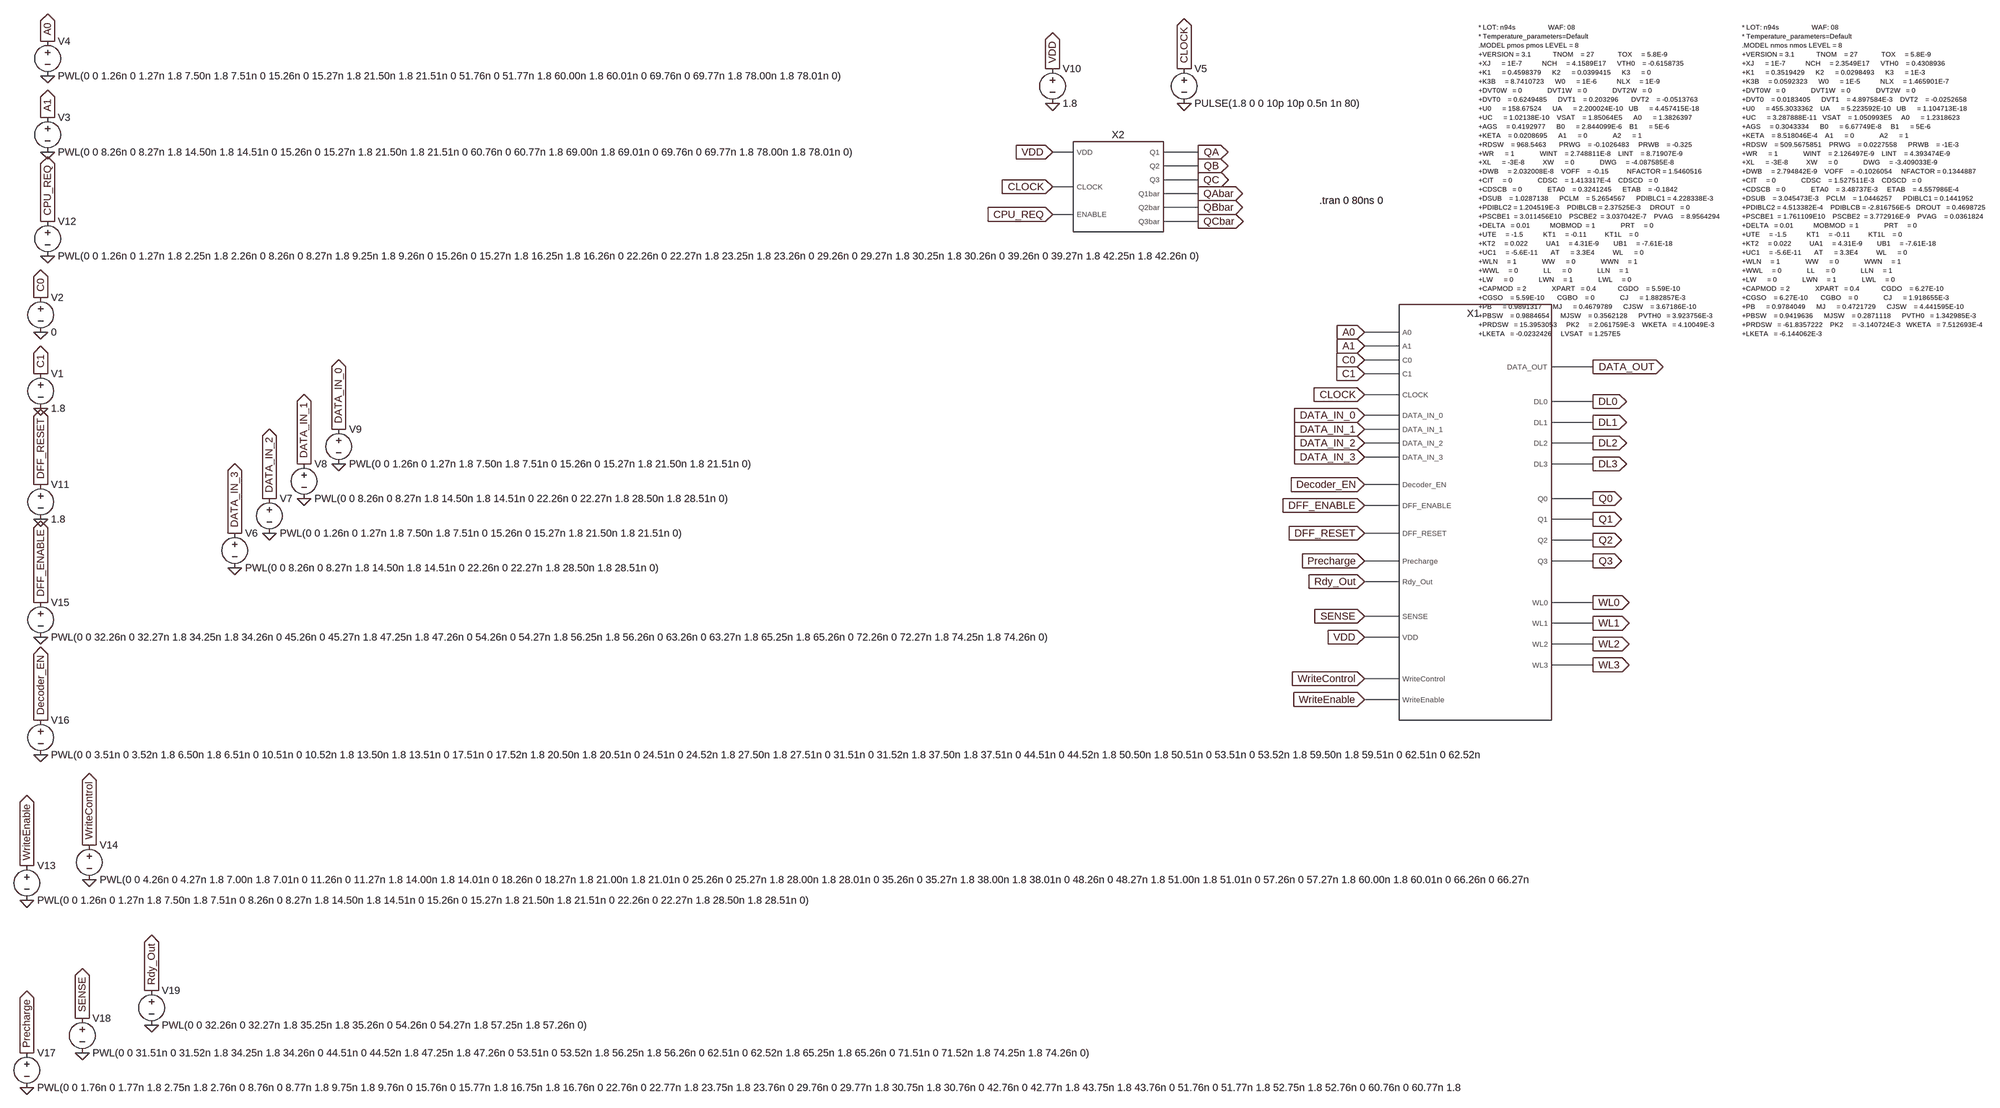
[diagram p0: schematic DRAM_CONTROLLER_2.asc]
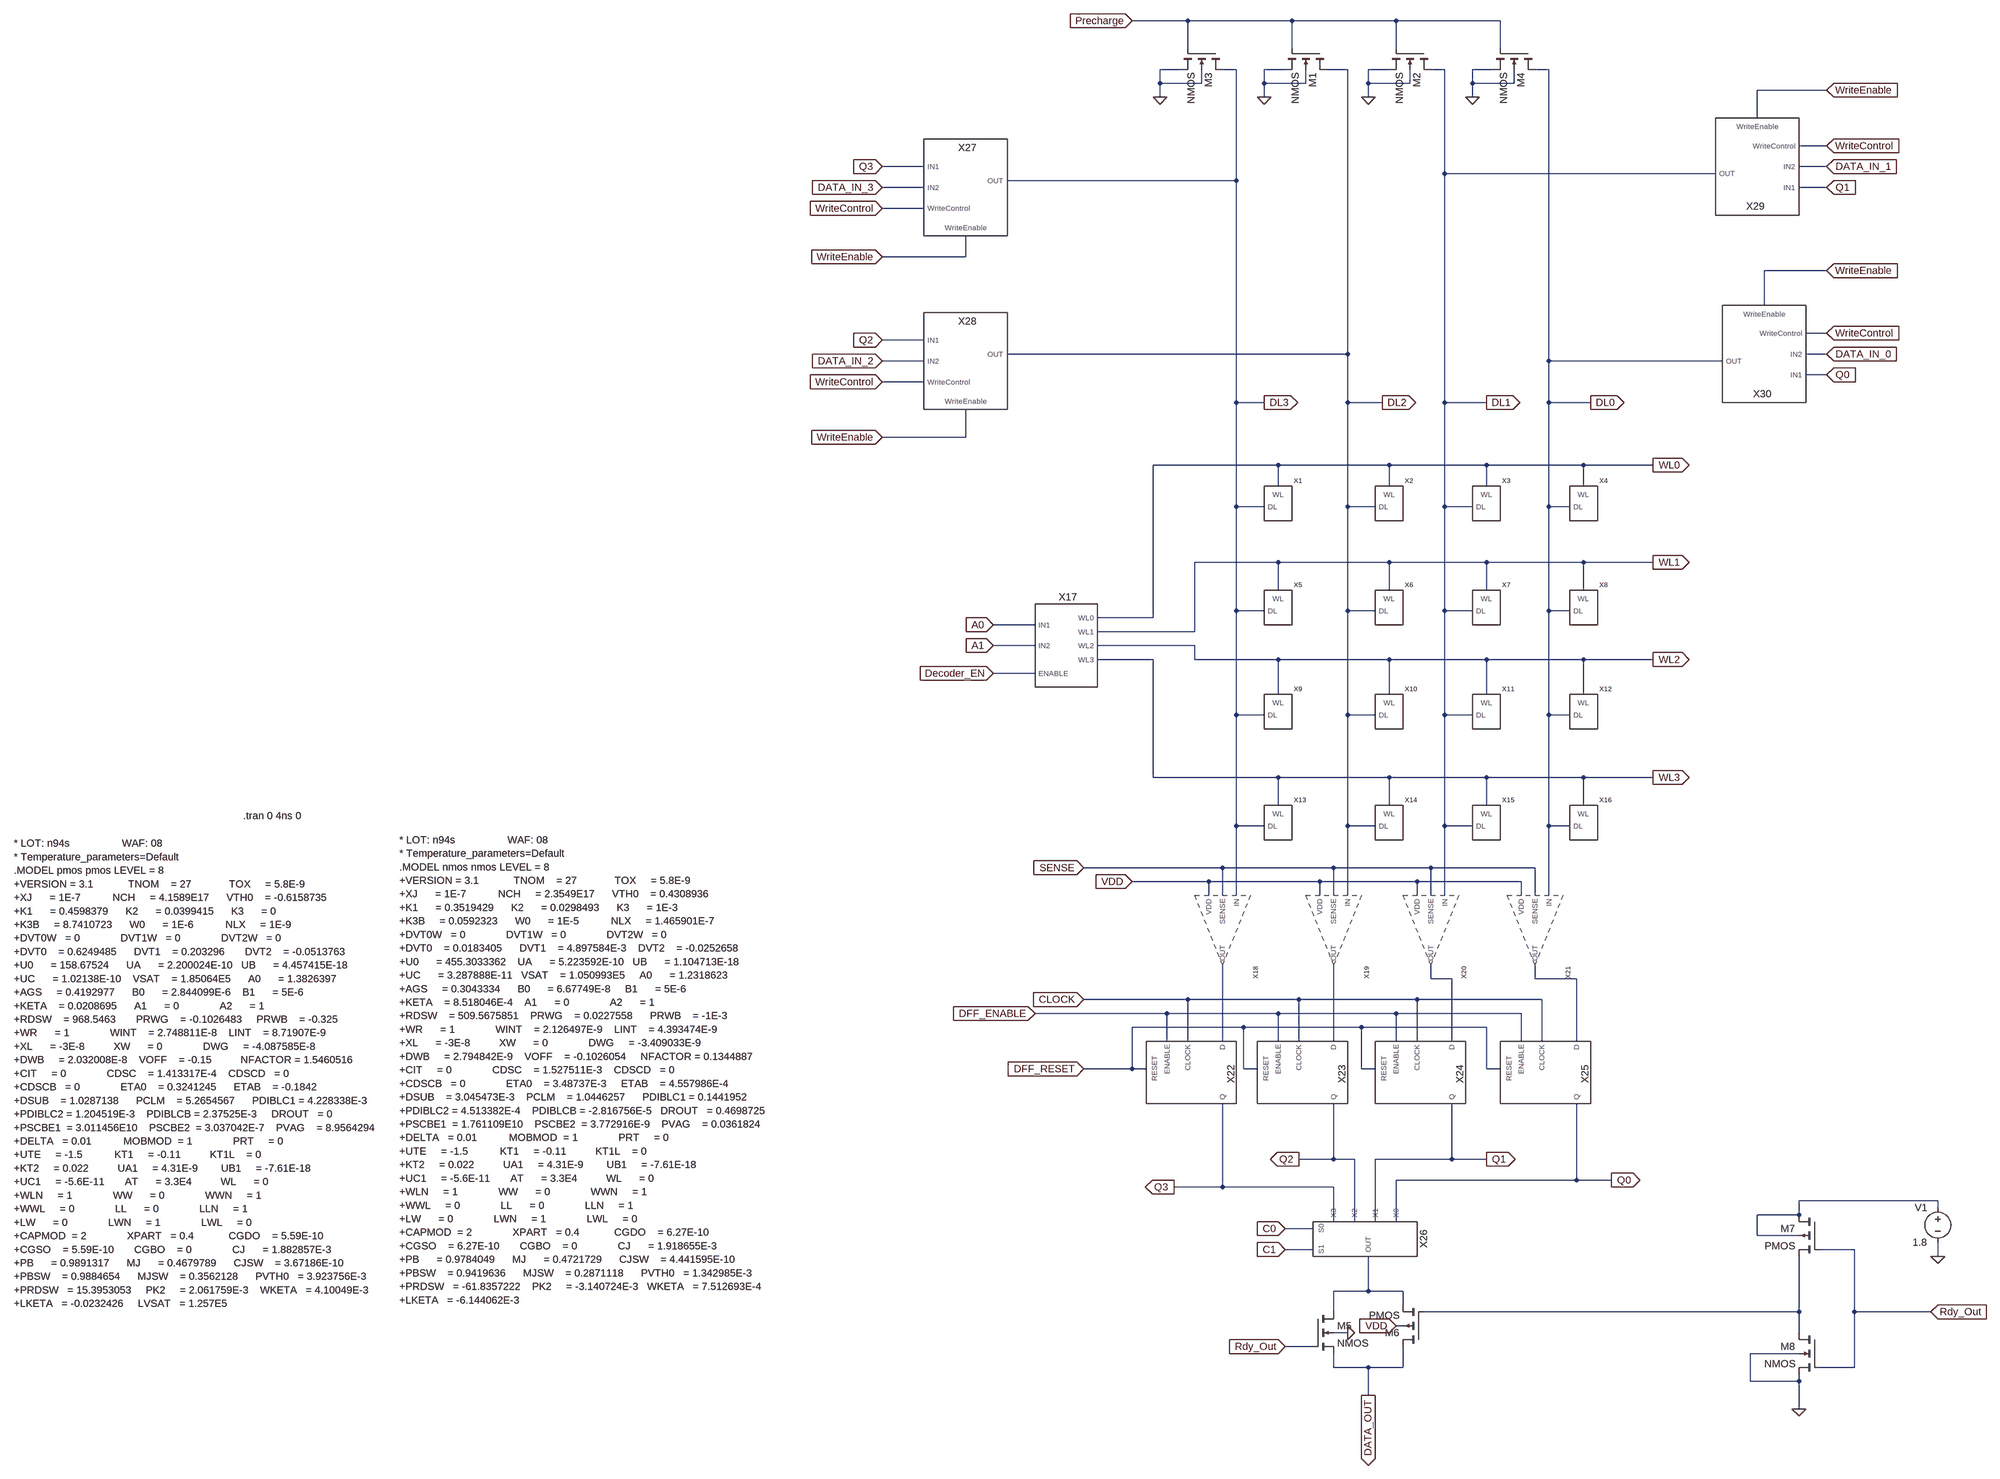
[diagram p1: sub-circuit 4x4_dram.asc]
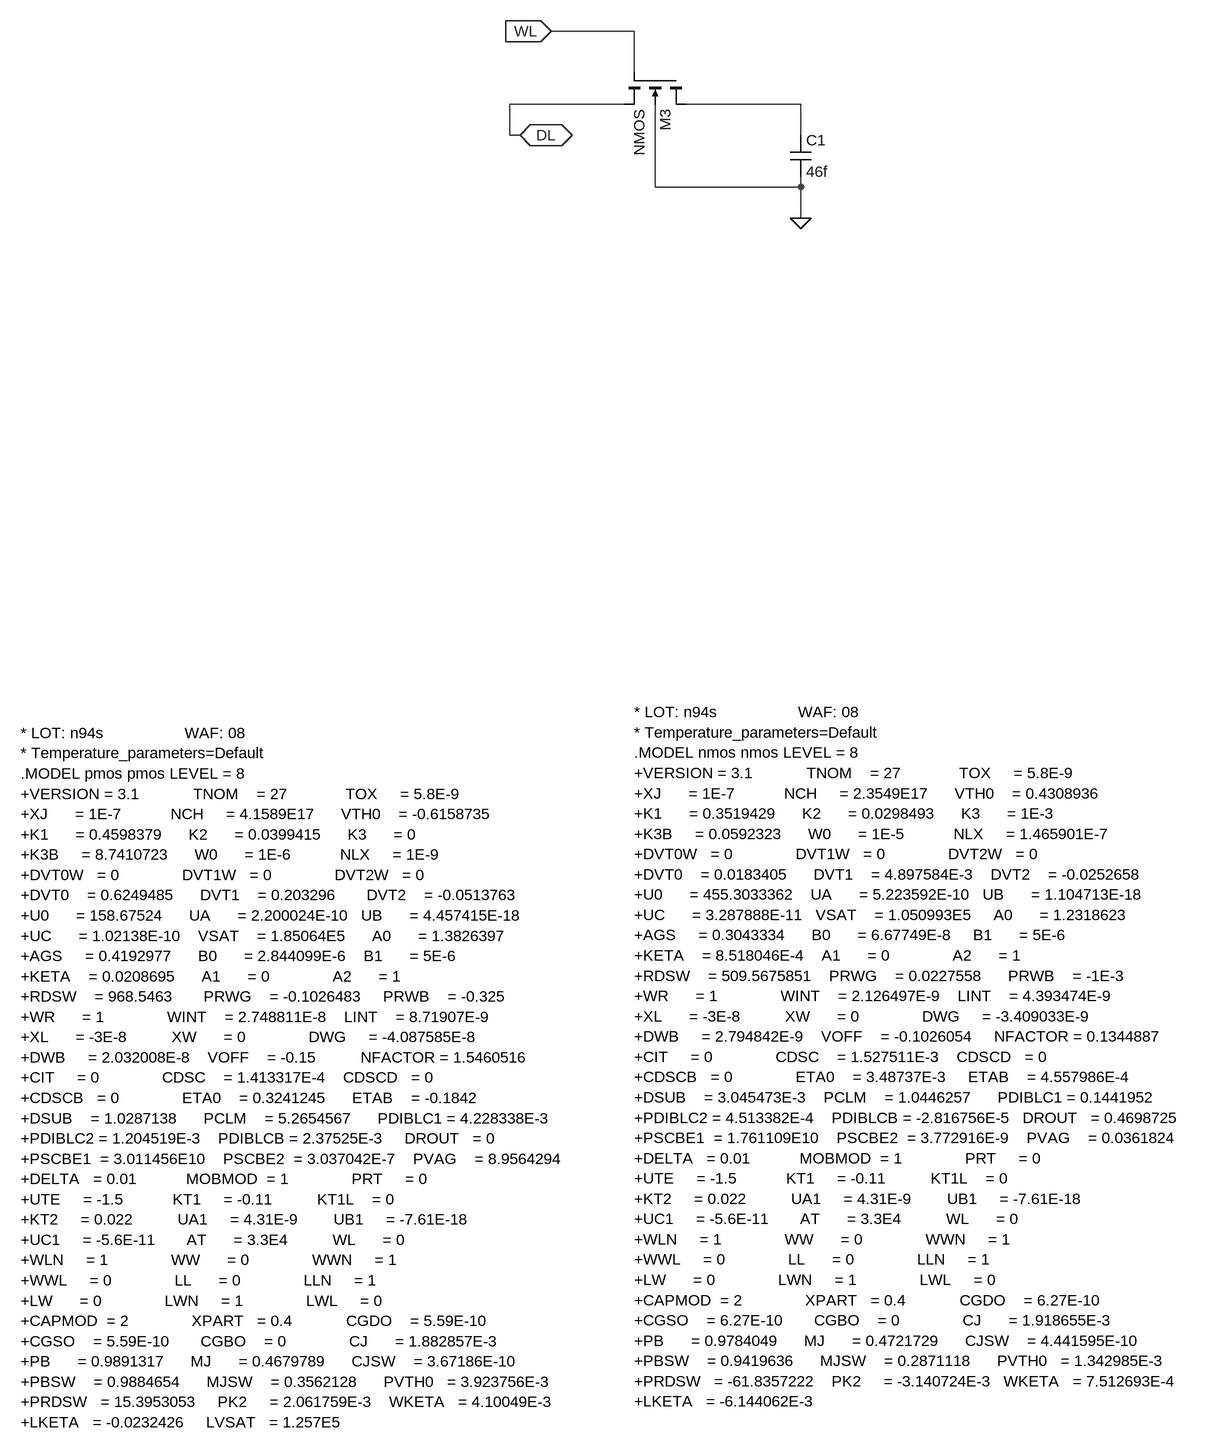
[diagram p2: sub-circuit 1t1c_cell.asc]
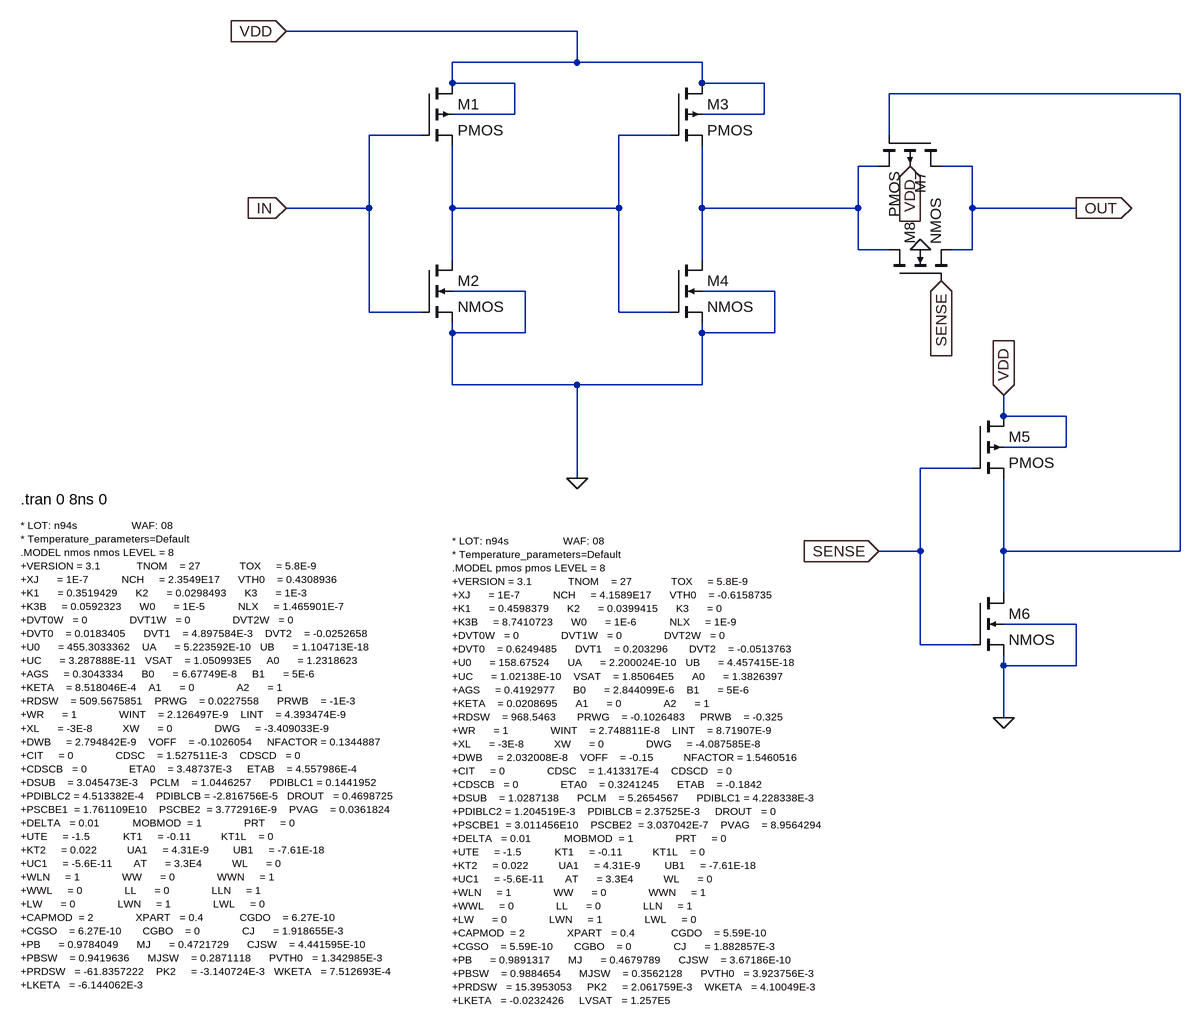
[diagram p3: sub-circuit sense_amplifier_en.asc]
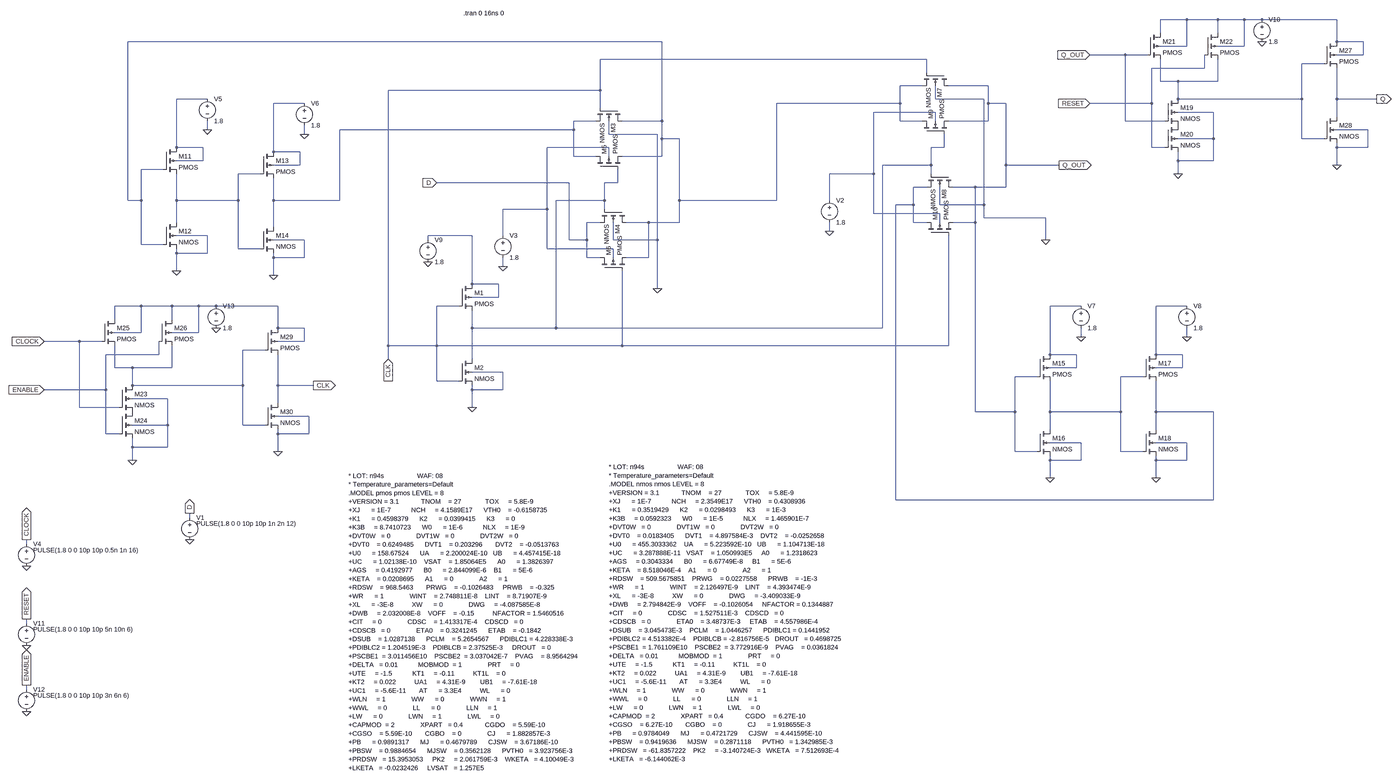
[diagram p4: sub-circuit dff_with_cntrs.asc, whole sheet]
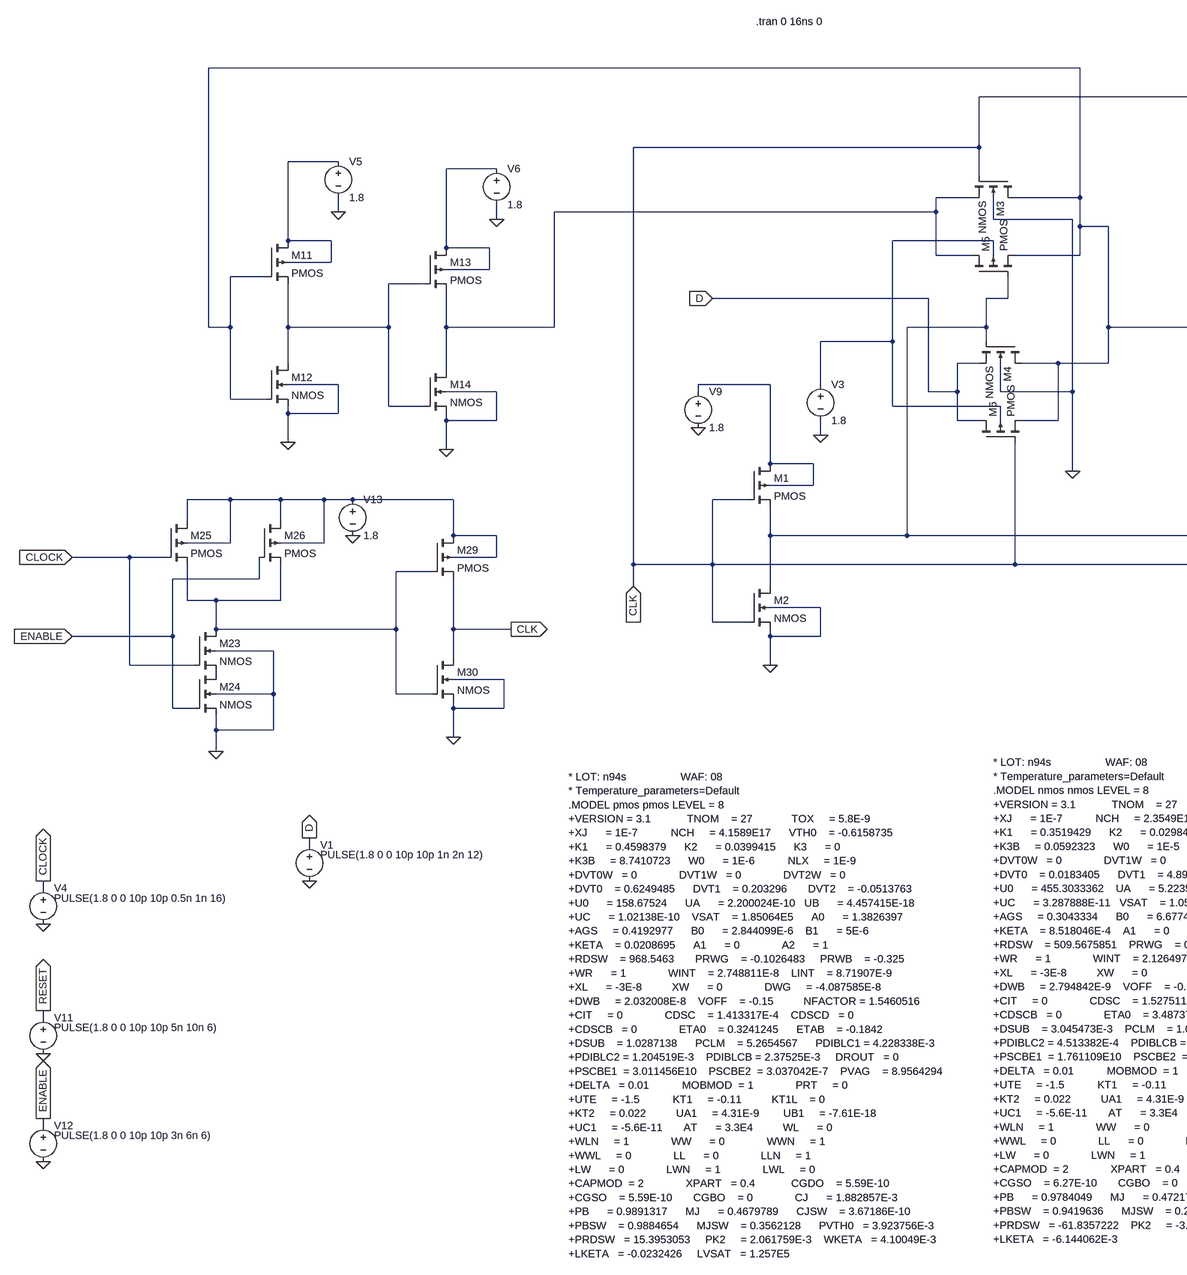
[diagram p5: sub-circuit dff_with_cntrs.asc, part, row 1 of 1, column 1 of 2]
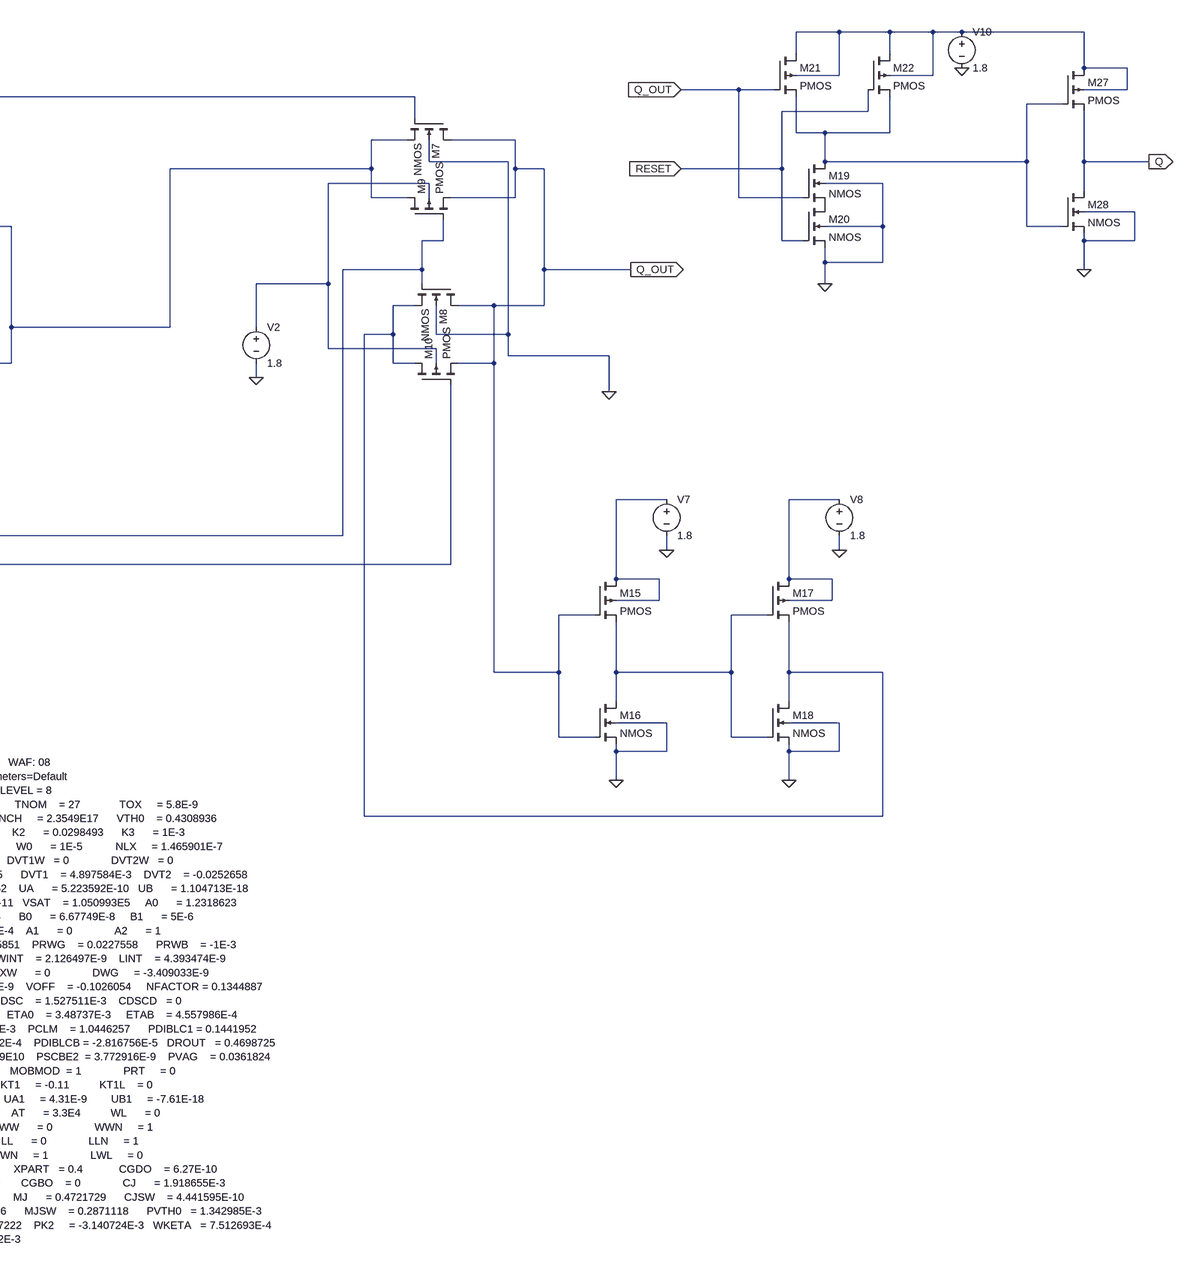
[diagram p6: sub-circuit dff_with_cntrs.asc, part, row 1 of 1, column 2 of 2]
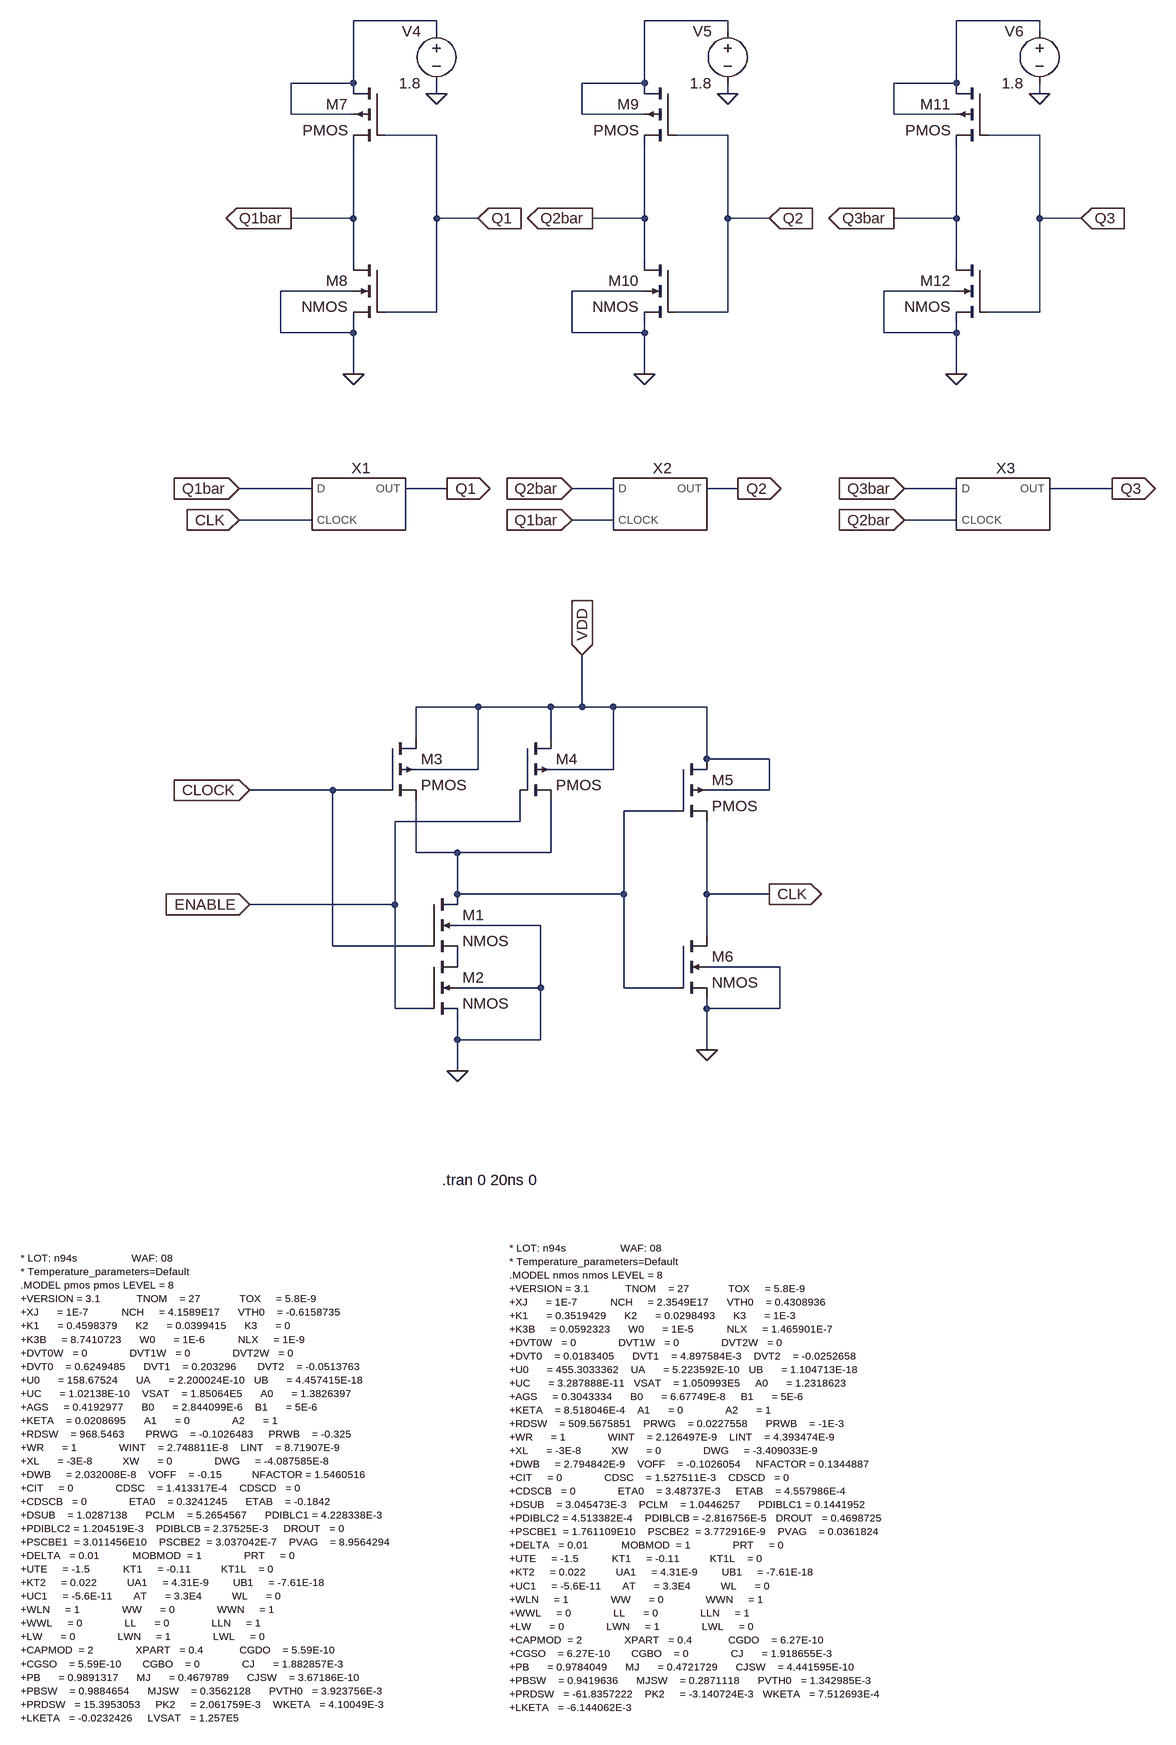
[diagram p7: sub-circuit 3bit_counter.asc]
DRAM_CONTROLLER_2.asc, the LTspice schematic file:
Version 4
SHEET 1 2300 1780
WIRE 112 -912 64 -912
WIRE 400 -912 320 -912
WIRE 400 -880 320 -880
WIRE 400 -848 320 -848
WIRE 112 -832 64 -832
WIRE 400 -816 320 -816
WIRE 400 -784 320 -784
WIRE 112 -768 64 -768
WIRE 400 -752 320 -752
WIRE 864 -496 784 -496
WIRE 864 -464 784 -464
WIRE 864 -432 784 -432
WIRE 1312 -416 1216 -416
WIRE 864 -400 784 -400
WIRE 864 -352 784 -352
WIRE 1312 -336 1216 -336
WIRE 864 -304 784 -304
WIRE 1312 -288 1216 -288
WIRE 864 -272 784 -272
WIRE 864 -240 784 -240
WIRE 1312 -240 1216 -240
WIRE 864 -208 784 -208
WIRE 1312 -192 1216 -192
WIRE 864 -144 784 -144
WIRE 1312 -112 1216 -112
WIRE 864 -96 784 -96
WIRE 1312 -64 1216 -64
WIRE 864 -32 784 -32
WIRE 1312 -16 1216 -16
WIRE 864 32 784 32
WIRE 1312 32 1216 32
WIRE 864 80 784 80
WIRE 1312 128 1216 128
WIRE 864 160 784 160
WIRE 1312 176 1216 176
WIRE 864 208 784 208
WIRE 1312 224 1216 224
WIRE 1312 272 1216 272
WIRE 864 304 784 304
WIRE 864 352 784 352
FLAG -2272 -320 0
FLAG -2272 -496 0
FLAG -2256 -912 0
FLAG -2256 -1088 0
FLAG -2256 -1168 A0
IOPIN -2256 -1168 Out
FLAG -2256 -992 A1
IOPIN -2256 -992 Out
FLAG -2272 -576 C0
IOPIN -2272 -576 Out
FLAG -2272 -400 C1
IOPIN -2272 -400 Out
FLAG 1312 128 WL0
IOPIN 1312 128 Out
FLAG 1312 176 WL1
IOPIN 1312 176 Out
FLAG 1312 224 WL2
IOPIN 1312 224 Out
FLAG 1312 272 WL3
IOPIN 1312 272 Out
FLAG 1312 32 Q3
IOPIN 1312 32 Out
FLAG 1312 -16 Q2
IOPIN 1312 -16 Out
FLAG 1312 -64 Q1
IOPIN 1312 -64 Out
FLAG 1312 -112 Q0
IOPIN 1312 -112 Out
FLAG 1312 -192 DL3
IOPIN 1312 -192 Out
FLAG 1312 -240 DL2
IOPIN 1312 -240 Out
FLAG 1312 -288 DL1
IOPIN 1312 -288 Out
FLAG 1312 -336 DL0
IOPIN 1312 -336 Out
FLAG 1312 -416 DATA_OUT
IOPIN 1312 -416 Out
FLAG 368 -1024 0
FLAG 368 -1104 CLOCK
IOPIN 368 -1104 Out
FLAG -1824 48 0
FLAG -1744 -32 0
FLAG -1664 -112 0
FLAG -1584 -192 0
FLAG -1584 -272 DATA_IN_0
IOPIN -1584 -272 Out
FLAG -1664 -192 DATA_IN_1
IOPIN -1664 -192 Out
FLAG -1744 -112 DATA_IN_2
IOPIN -1744 -112 Out
FLAG -1824 -32 DATA_IN_3
IOPIN -1824 -32 Out
FLAG 64 -1024 0
FLAG 64 -1104 VDD
IOPIN 64 -1104 Out
FLAG -2272 -64 0
FLAG -2272 -144 DFF_RESET
IOPIN -2272 -144 Out
FLAG -2256 -672 0
FLAG -2256 -752 CPU_REQ
IOPIN -2256 -752 Out
FLAG -2304 816 0
FLAG -2304 736 WriteEnable
IOPIN -2304 736 Out
FLAG -2160 768 0
FLAG -2160 688 WriteControl
IOPIN -2160 688 Out
FLAG -2272 208 0
FLAG -2272 128 DFF_ENABLE
IOPIN -2272 128 Out
FLAG -2272 480 0
FLAG -2272 400 Decoder_EN
IOPIN -2272 400 Out
FLAG -2304 1248 0
FLAG -2304 1168 Precharge
IOPIN -2304 1168 Out
FLAG -2176 1168 0
FLAG -2176 1088 SENSE
IOPIN -2176 1088 Out
FLAG -2016 1104 0
FLAG -2016 1024 Rdy_Out
IOPIN -2016 1024 Out
FLAG 784 -496 A0
IOPIN 784 -496 In
FLAG 784 -464 A1
IOPIN 784 -464 In
FLAG 784 -432 C0
IOPIN 784 -432 In
FLAG 784 -400 C1
IOPIN 784 -400 In
FLAG 784 -352 CLOCK
IOPIN 784 -352 In
FLAG 784 -304 DATA_IN_0
IOPIN 784 -304 In
FLAG 784 -272 DATA_IN_1
IOPIN 784 -272 In
FLAG 784 -240 DATA_IN_2
IOPIN 784 -240 In
FLAG 784 -208 DATA_IN_3
IOPIN 784 -208 In
FLAG 784 -144 Decoder_EN
IOPIN 784 -144 In
FLAG 784 -96 DFF_ENABLE
IOPIN 784 -96 In
FLAG 784 -32 DFF_RESET
IOPIN 784 -32 In
FLAG 784 32 Precharge
IOPIN 784 32 In
FLAG 784 80 Rdy_Out
IOPIN 784 80 In
FLAG 784 160 SENSE
IOPIN 784 160 In
FLAG 784 208 VDD
IOPIN 784 208 In
FLAG 784 304 WriteControl
IOPIN 784 304 In
FLAG 784 352 WriteEnable
IOPIN 784 352 In
FLAG 64 -768 CPU_REQ
IOPIN 64 -768 In
FLAG 64 -832 CLOCK
IOPIN 64 -832 In
FLAG 64 -912 VDD
IOPIN 64 -912 In
FLAG 400 -912 QA
IOPIN 400 -912 Out
FLAG 400 -880 QB
IOPIN 400 -880 Out
FLAG 400 -848 QC
IOPIN 400 -848 Out
FLAG 400 -816 QAbar
IOPIN 400 -816 Out
FLAG 400 -784 QBbar
IOPIN 400 -784 Out
FLAG 400 -752 QCbar
IOPIN 400 -752 Out
SYMBOL Voltage -2272 -416 R0
SYMATTR InstName V1
SYMATTR Value 1.8
SYMBOL Voltage -2272 -592 R0
SYMATTR InstName V2
SYMATTR Value 0
SYMBOL Voltage -2256 -1008 R0
SYMATTR InstName V3
SYMATTR Value PWL(0 0 8.26n 0 8.27n 1.8 14.50n 1.8 14.51n 0 15.26n 0 15.27n 1.8 21.50n 1.8 21.51n 0 60.76n 0 60.77n 1.8 69.00n 1.8 69.01n 0 69.76n 0 69.77n 1.8 78.00n 1.8 78.01n 0)
SYMBOL Voltage -2256 -1184 R0
SYMATTR InstName V4
SYMATTR Value PWL(0 0 1.26n 0 1.27n 1.8 7.50n 1.8 7.51n 0 15.26n 0 15.27n 1.8 21.50n 1.8 21.51n 0 51.76n 0 51.77n 1.8 60.00n 1.8 60.01n 0 69.76n 0 69.77n 1.8 78.00n 1.8 78.01n 0)
SYMBOL 4X4_DRAM 1040 16 R0
SYMATTR InstName X1
SYMBOL Voltage 368 -1120 R0
SYMATTR InstName V5
SYMATTR Value PULSE(1.8 0 0 10p 10p 0.5n 1n 80)
SYMBOL Voltage -1824 -48 R0
SYMATTR InstName V6
SYMATTR Value PWL(0 0 8.26n 0 8.27n 1.8 14.50n 1.8 14.51n 0 22.26n 0 22.27n 1.8 28.50n 1.8 28.51n 0)
SYMBOL Voltage -1744 -128 R0
SYMATTR InstName V7
SYMATTR Value PWL(0 0 1.26n 0 1.27n 1.8 7.50n 1.8 7.51n 0 15.26n 0 15.27n 1.8 21.50n 1.8 21.51n 0)
SYMBOL Voltage -1664 -208 R0
SYMATTR InstName V8
SYMATTR Value PWL(0 0 8.26n 0 8.27n 1.8 14.50n 1.8 14.51n 0 22.26n 0 22.27n 1.8 28.50n 1.8 28.51n 0)
SYMBOL Voltage -1584 -288 R0
SYMATTR InstName V9
SYMATTR Value PWL(0 0 1.26n 0 1.27n 1.8 7.50n 1.8 7.51n 0 15.26n 0 15.27n 1.8 21.50n 1.8 21.51n 0)
SYMBOL Voltage 64 -1120 R0
SYMATTR InstName V10
SYMATTR Value 1.8
SYMBOL Voltage -2272 -160 R0
SYMATTR InstName V11
SYMATTR Value 1.8
SYMBOL Voltage -2256 -768 R0
SYMATTR InstName V12
SYMATTR Value PWL(0 0 1.26n 0 1.27n 1.8 2.25n 1.8 2.26n 0 8.26n 0 8.27n 1.8 9.25n 1.8 9.26n 0 15.26n 0 15.27n 1.8 16.25n 1.8 16.26n 0 22.26n 0 22.27n 1.8 23.25n 1.8 23.26n 0 29.26n 0 29.27n 1.8 30.25n 1.8 30.26n 0 39.26n 0 39.27n 1.8 42.25n 1.8 42.26n 0)
SYMBOL Voltage -2304 720 R0
SYMATTR InstName V13
SYMATTR Value PWL(0 0 1.26n 0 1.27n 1.8 7.50n 1.8 7.51n 0 8.26n 0 8.27n 1.8 14.50n 1.8 14.51n 0 15.26n 0 15.27n 1.8 21.50n 1.8 21.51n 0 22.26n 0 22.27n 1.8 28.50n 1.8 28.51n 0)
SYMBOL Voltage -2160 672 R0
SYMATTR InstName V14
SYMATTR Value PWL(0 0 4.26n 0 4.27n 1.8 7.00n 1.8 7.01n 0 11.26n 0 11.27n 1.8 14.00n 1.8 14.01n 0 18.26n 0 18.27n 1.8 21.00n 1.8 21.01n 0 25.26n 0 25.27n 1.8 28.00n 1.8 28.01n 0 35.26n 0 35.27n 1.8 38.00n 1.8 38.01n 0 48.26n 0 48.27n 1.8 51.00n 1.8 51.01n 0 57.26n 0 57.27n 1.8 60.00n 1.8 60.01n 0 66.26n 0 66.27n 1.8 69.00n 1.8 69.01n 0 75.26n 0 75.27n 1.8 78.00n 1.8 78.01n 0)
SYMBOL Voltage -2272 112 R0
SYMATTR InstName V15
SYMATTR Value PWL(0 0 32.26n 0 32.27n 1.8 34.25n 1.8 34.26n 0 45.26n 0 45.27n 1.8 47.25n 1.8 47.26n 0 54.26n 0 54.27n 1.8 56.25n 1.8 56.26n 0 63.26n 0 63.27n 1.8 65.25n 1.8 65.26n 0 72.26n 0 72.27n 1.8 74.25n 1.8 74.26n 0)
SYMBOL Voltage -2272 384 R0
SYMATTR InstName V16
SYMATTR Value PWL(0 0 3.51n 0 3.52n 1.8 6.50n 1.8 6.51n 0 10.51n 0 10.52n 1.8 13.50n 1.8 13.51n 0 17.51n 0 17.52n 1.8 20.50n 1.8 20.51n 0 24.51n 0 24.52n 1.8 27.50n 1.8 27.51n 0 31.51n 0 31.52n 1.8 37.50n 1.8 37.51n 0 44.51n 0 44.52n 1.8 50.50n 1.8 50.51n 0 53.51n 0 53.52n 1.8 59.50n 1.8 59.51n 0 62.51n 0 62.52n 1.8 68.50n 1.8 68.51n 0 71.51n 0 71.52n 1.8 77.50n 1.8 77.51n 0)
SYMBOL Voltage -2304 1152 R0
SYMATTR InstName V17
SYMATTR Value PWL(0 0 1.76n 0 1.77n 1.8 2.75n 1.8 2.76n 0 8.76n 0 8.77n 1.8 9.75n 1.8 9.76n 0 15.76n 0 15.77n 1.8 16.75n 1.8 16.76n 0 22.76n 0 22.77n 1.8 23.75n 1.8 23.76n 0 29.76n 0 29.77n 1.8 30.75n 1.8 30.76n 0 42.76n 0 42.77n 1.8 43.75n 1.8 43.76n 0 51.76n 0 51.77n 1.8 52.75n 1.8 52.76n 0 60.76n 0 60.77n 1.8 61.75n 1.8 61.76n 0 69.76n 0 69.77n 1.8 70.75n 1.8 70.76n 0)
SYMBOL Voltage -2176 1072 R0
SYMATTR InstName V18
SYMATTR Value PWL(0 0 31.51n 0 31.52n 1.8 34.25n 1.8 34.26n 0 44.51n 0 44.52n 1.8 47.25n 1.8 47.26n 0 53.51n 0 53.52n 1.8 56.25n 1.8 56.26n 0 62.51n 0 62.52n 1.8 65.25n 1.8 65.26n 0 71.51n 0 71.52n 1.8 74.25n 1.8 74.26n 0)
SYMBOL Voltage -2016 1008 R0
SYMATTR InstName V19
SYMATTR Value PWL(0 0 32.26n 0 32.27n 1.8 35.25n 1.8 35.26n 0 54.26n 0 54.27n 1.8 57.25n 1.8 57.26n 0)
SYMBOL 3bit_Counter 208 -832 R0
SYMATTR InstName X2
TEXT 680 -800 Left 2 !.tran 0 80ns 0
TEXT 1656 -1200 Left 1 !* LOT: n94s                  WAF: 08\n* Temperature_parameters=Default\n.MODEL nmos nmos LEVEL = 8\n+VERSION = 3.1            TNOM    = 27             TOX     = 5.8E-9\n+XJ      = 1E-7           NCH     = 2.3549E17      VTH0    = 0.4308936\n+K1      = 0.3519429      K2      = 0.0298493      K3      = 1E-3\n+K3B     = 0.0592323      W0      = 1E-5           NLX     = 1.465901E-7\n+DVT0W   = 0              DVT1W   = 0              DVT2W   = 0\n+DVT0    = 0.0183405      DVT1    = 4.897584E-3    DVT2    = -0.0252658\n+U0      = 455.3033362    UA      = 5.223592E-10   UB      = 1.104713E-18\n+UC      = 3.287888E-11   VSAT    = 1.050993E5     A0      = 1.2318623\n+AGS     = 0.3043334      B0      = 6.67749E-8     B1      = 5E-6\n+KETA    = 8.518046E-4    A1      = 0              A2      = 1\n+RDSW    = 509.5675851    PRWG    = 0.0227558      PRWB    = -1E-3\n+WR      = 1              WINT    = 2.126497E-9    LINT    = 4.393474E-9\n+XL      = -3E-8          XW      = 0              DWG     = -3.409033E-9\n+DWB     = 2.794842E-9    VOFF    = -0.1026054     NFACTOR = 0.1344887\n+CIT     = 0              CDSC    = 1.527511E-3    CDSCD   = 0\n+CDSCB   = 0              ETA0    = 3.48737E-3     ETAB    = 4.557986E-4\n+DSUB    = 3.045473E-3    PCLM    = 1.0446257      PDIBLC1 = 0.1441952\n+PDIBLC2 = 4.513382E-4    PDIBLCB = -2.816756E-5   DROUT   = 0.4698725\n+PSCBE1  = 1.761109E10    PSCBE2  = 3.772916E-9    PVAG    = 0.0361824\n+DELTA   = 0.01           MOBMOD  = 1              PRT     = 0\n+UTE     = -1.5           KT1     = -0.11          KT1L    = 0\n+KT2     = 0.022          UA1     = 4.31E-9        UB1     = -7.61E-18\n+UC1     = -5.6E-11       AT      = 3.3E4          WL      = 0\n+WLN     = 1              WW      = 0              WWN     = 1\n+WWL     = 0              LL      = 0              LLN     = 1\n+LW      = 0              LWN     = 1              LWL     = 0\n+CAPMOD  = 2              XPART   = 0.4            CGDO    = 6.27E-10\n+CGSO    = 6.27E-10       CGBO    = 0              CJ      = 1.918655E-3\n+PB      = 0.9784049      MJ      = 0.4721729      CJSW    = 4.441595E-10\n+PBSW    = 0.9419636      MJSW    = 0.2871118      PVTH0   = 1.342985E-3\n+PRDSW   = -61.8357222    PK2     = -3.140724E-3   WKETA   = 7.512693E-4\n+LKETA   = -6.144062E-3
TEXT 1048 -1200 Left 1 !* LOT: n94s                  WAF: 08\n* Temperature_parameters=Default\n.MODEL pmos pmos LEVEL = 8\n+VERSION = 3.1            TNOM    = 27             TOX     = 5.8E-9\n+XJ      = 1E-7           NCH     = 4.1589E17      VTH0    = -0.6158735\n+K1      = 0.4598379      K2      = 0.0399415      K3      = 0\n+K3B     = 8.7410723      W0      = 1E-6           NLX     = 1E-9\n+DVT0W   = 0              DVT1W   = 0              DVT2W   = 0\n+DVT0    = 0.6249485      DVT1    = 0.203296       DVT2    = -0.0513763\n+U0      = 158.67524      UA      = 2.200024E-10   UB      = 4.457415E-18\n+UC      = 1.02138E-10    VSAT    = 1.85064E5      A0      = 1.3826397\n+AGS     = 0.4192977      B0      = 2.844099E-6    B1      = 5E-6\n+KETA    = 0.0208695      A1      = 0              A2      = 1\n+RDSW    = 968.5463       PRWG    = -0.1026483     PRWB    = -0.325\n+WR      = 1              WINT    = 2.748811E-8    LINT    = 8.71907E-9\n+XL      = -3E-8          XW      = 0              DWG     = -4.087585E-8\n+DWB     = 2.032008E-8    VOFF    = -0.15          NFACTOR = 1.5460516\n+CIT     = 0              CDSC    = 1.413317E-4    CDSCD   = 0\n+CDSCB   = 0              ETA0    = 0.3241245      ETAB    = -0.1842\n+DSUB    = 1.0287138      PCLM    = 5.2654567      PDIBLC1 = 4.228338E-3\n+PDIBLC2 = 1.204519E-3    PDIBLCB = 2.37525E-3     DROUT   = 0\n+PSCBE1  = 3.011456E10    PSCBE2  = 3.037042E-7    PVAG    = 8.9564294\n+DELTA   = 0.01           MOBMOD  = 1              PRT     = 0\n+UTE     = -1.5           KT1     = -0.11          KT1L    = 0\n+KT2     = 0.022          UA1     = 4.31E-9        UB1     = -7.61E-18\n+UC1     = -5.6E-11       AT      = 3.3E4          WL      = 0\n+WLN     = 1              WW      = 0              WWN     = 1\n+WWL     = 0              LL      = 0              LLN     = 1\n+LW      = 0              LWN     = 1              LWL     = 0\n+CAPMOD  = 2              XPART   = 0.4            CGDO    = 5.59E-10\n+CGSO    = 5.59E-10       CGBO    = 0              CJ      = 1.882857E-3\n+PB      = 0.9891317      MJ      = 0.4679789      CJSW    = 3.67186E-10\n+PBSW    = 0.9884654      MJSW    = 0.3562128      PVTH0   = 3.923756E-3\n+PRDSW   = 15.3953053     PK2     = 2.061759E-3    WKETA   = 4.10049E-3\n+LKETA   = -0.0232426     LVSAT   = 1.257E5

The netlist it stands for:
* DRAM_CONTROLLER_2.asc
V1 C1 0 1.8
V2 C0 0 0
V3 A1 0 PWL(0 0 8.26n 0 8.27n 1.8 14.50n 1.8 14.51n 0 15.26n 0 15.27n 1.8 21.50n 1.8 21.51n 0 60.76n 0 60.77n 1.8 69.00n 1.8 69.01n 0 69.76n 0 69.77n 1.8 78.00n 1.8 78.01n 0)
V4 A0 0 PWL(0 0 1.26n 0 1.27n 1.8 7.50n 1.8 7.51n 0 15.26n 0 15.27n 1.8 21.50n 1.8 21.51n 0 51.76n 0 51.77n 1.8 60.00n 1.8 60.01n 0 69.76n 0 69.77n 1.8 78.00n 1.8 78.01n 0)
XX1 A0 A1 C0 C1 CLOCK DATA_IN_0 DATA_IN_1 DATA_IN_2 DATA_IN_3 Decoder_EN DFF_ENABLE DFF_RESET Precharge Rdy_Out SENSE VDD WriteControl WriteEnable DATA_OUT DL0 DL1 DL2 DL3 Q0 Q1 Q2 Q3 WL0 WL1 WL2 WL3 4x4_dram
V5 CLOCK 0 PULSE(1.8 0 0 10p 10p 0.5n 1n 80)
V6 DATA_IN_3 0 PWL(0 0 8.26n 0 8.27n 1.8 14.50n 1.8 14.51n 0 22.26n 0 22.27n 1.8 28.50n 1.8 28.51n 0)
V7 DATA_IN_2 0 PWL(0 0 1.26n 0 1.27n 1.8 7.50n 1.8 7.51n 0 15.26n 0 15.27n 1.8 21.50n 1.8 21.51n 0)
V8 DATA_IN_1 0 PWL(0 0 8.26n 0 8.27n 1.8 14.50n 1.8 14.51n 0 22.26n 0 22.27n 1.8 28.50n 1.8 28.51n 0)
V9 DATA_IN_0 0 PWL(0 0 1.26n 0 1.27n 1.8 7.50n 1.8 7.51n 0 15.26n 0 15.27n 1.8 21.50n 1.8 21.51n 0)
V10 VDD 0 1.8
V11 DFF_RESET 0 1.8
V12 CPU_REQ 0 PWL(0 0 1.26n 0 1.27n 1.8 2.25n 1.8 2.26n 0 8.26n 0 8.27n 1.8 9.25n 1.8 9.26n 0 15.26n 0 15.27n 1.8 16.25n 1.8 16.26n 0 22.26n 0 22.27n 1.8 23.25n 1.8 23.26n 0 29.26n 0 29.27n 1.8 30.25n 1.8 30.26n 0 39.26n 0 39.27n 1.8 42.25n 1.8 42.26n 0)
V13 WriteEnable 0 PWL(0 0 1.26n 0 1.27n 1.8 7.50n 1.8 7.51n 0 8.26n 0 8.27n 1.8 14.50n 1.8 14.51n 0 15.26n 0 15.27n 1.8 21.50n 1.8 21.51n 0 22.26n 0 22.27n 1.8 28.50n 1.8 28.51n 0)
V14 WriteControl 0 PWL(0 0 4.26n 0 4.27n 1.8 7.00n 1.8 7.01n 0 11.26n 0 11.27n 1.8 14.00n 1.8 14.01n 0 18.26n 0 18.27n 1.8 21.00n 1.8 21.01n 0 25.26n 0 25.27n 1.8 28.00n 1.8 28.01n 0 35.26n 0 35.27n 1.8 38.00n 1.8 38.01n 0 48.26n 0 48.27n 1.8 51.00n 1.8 51.01n 0 57.26n 0 57.27n 1.8 60.00n 1.8 60.01n 0 66.26n 0 66.27n 1.8 69.00n 1.8 69.01n 0 75.26n 0 75.27n 1.8 78.00n 1.8 78.01n 0)
V15 DFF_ENABLE 0 PWL(0 0 32.26n 0 32.27n 1.8 34.25n 1.8 34.26n 0 45.26n 0 45.27n 1.8 47.25n 1.8 47.26n 0 54.26n 0 54.27n 1.8 56.25n 1.8 56.26n 0 63.26n 0 63.27n 1.8 65.25n 1.8 65.26n 0 72.26n 0 72.27n 1.8 74.25n 1.8 74.26n 0)
V16 Decoder_EN 0 PWL(0 0 3.51n 0 3.52n 1.8 6.50n 1.8 6.51n 0 10.51n 0 10.52n 1.8 13.50n 1.8 13.51n 0 17.51n 0 17.52n 1.8 20.50n 1.8 20.51n 0 24.51n 0 24.52n 1.8 27.50n 1.8 27.51n 0 31.51n 0 31.52n 1.8 37.50n 1.8 37.51n 0 44.51n 0 44.52n 1.8 50.50n 1.8 50.51n 0 53.51n 0 53.52n 1.8 59.50n 1.8 59.51n 0 62.51n 0 62.52n 1.8 68.50n 1.8 68.51n 0 71.51n 0 71.52n 1.8 77.50n 1.8 77.51n 0)
V17 Precharge 0 PWL(0 0 1.76n 0 1.77n 1.8 2.75n 1.8 2.76n 0 8.76n 0 8.77n 1.8 9.75n 1.8 9.76n 0 15.76n 0 15.77n 1.8 16.75n 1.8 16.76n 0 22.76n 0 22.77n 1.8 23.75n 1.8 23.76n 0 29.76n 0 29.77n 1.8 30.75n 1.8 30.76n 0 42.76n 0 42.77n 1.8 43.75n 1.8 43.76n 0 51.76n 0 51.77n 1.8 52.75n 1.8 52.76n 0 60.76n 0 60.77n 1.8 61.75n 1.8 61.76n 0 69.76n 0 69.77n 1.8 70.75n 1.8 70.76n 0)
V18 SENSE 0 PWL(0 0 31.51n 0 31.52n 1.8 34.25n 1.8 34.26n 0 44.51n 0 44.52n 1.8 47.25n 1.8 47.26n 0 53.51n 0 53.52n 1.8 56.25n 1.8 56.26n 0 62.51n 0 62.52n 1.8 65.25n 1.8 65.26n 0 71.51n 0 71.52n 1.8 74.25n 1.8 74.26n 0)
V19 Rdy_Out 0 PWL(0 0 32.26n 0 32.27n 1.8 35.25n 1.8 35.26n 0 54.26n 0 54.27n 1.8 57.25n 1.8 57.26n 0)
XX2 CLOCK CPU_REQ VDD QA QAbar QB QBbar QC QCbar 3bit_counter

* block symbol definitions
.subckt 4x4_dram A0 A1 C0 C1 CLOCK DATA_IN_0 DATA_IN_1 DATA_IN_2 DATA_IN_3 Decoder_EN DFF_ENABLE DFF_RESET Precharge Rdy_Out SENSE VDD WriteControl WriteEnable DATA_OUT DL0 DL1 DL2 DL3 Q0 Q1 Q2 Q3 WL0 WL1 WL2 WL3
M3 DL3 Precharge 0 0 NMOS l=180n w=440n
XX1 DL3 WL0 1t1c_cell
XX2 DL2 WL0 1t1c_cell
XX3 DL1 WL0 1t1c_cell
XX4 DL0 WL0 1t1c_cell
XX5 DL3 WL1 1t1c_cell
XX6 DL2 WL1 1t1c_cell
XX7 DL1 WL1 1t1c_cell
XX8 DL0 WL1 1t1c_cell
XX9 DL3 WL2 1t1c_cell
XX10 DL2 WL2 1t1c_cell
XX11 DL1 WL2 1t1c_cell
XX12 DL0 WL2 1t1c_cell
XX13 DL3 WL3 1t1c_cell
XX14 DL2 WL3 1t1c_cell
XX15 DL1 WL3 1t1c_cell
XX16 DL0 WL3 1t1c_cell
M1 DL2 Precharge 0 0 NMOS l=180n w=440n
M2 DL1 Precharge 0 0 NMOS l=180n w=440n
M4 DL0 Precharge 0 0 NMOS l=180n w=440n
XX17 Decoder_EN A0 A1 WL0 WL1 WL2 WL3 2x4_DECODER_En  ; pins ENABLE IN1 IN2 WL0 WL1 WL2 WL3
XX18 DL3 SENSE VDD N003 sense_amplifier_en
XX19 DL2 SENSE VDD N004 sense_amplifier_en
XX20 DL1 SENSE VDD N001 sense_amplifier_en
XX21 DL0 SENSE VDD N002 sense_amplifier_en
XX22 CLOCK N003 DFF_ENABLE DFF_RESET Q3 dff_with_cntrs
XX23 CLOCK N004 DFF_ENABLE DFF_RESET Q2 dff_with_cntrs
XX24 CLOCK N001 DFF_ENABLE DFF_RESET Q1 dff_with_cntrs
XX25 CLOCK N002 DFF_ENABLE DFF_RESET Q0 dff_with_cntrs
XX26 N006 C0 C1 Q0 Q1 Q2 Q3 4X1_MUX  ; pins OUT S0 S1 X0 X1 X2 X3
XX27 Q3 DATA_IN_3 WriteControl WriteEnable DL3 2x1_MUX  ; pins IN1 IN2 WriteControl WriteEnable OUT
XX28 Q2 DATA_IN_2 WriteControl WriteEnable DL2 2x1_MUX  ; pins IN1 IN2 WriteControl WriteEnable OUT
XX29 Q1 DATA_IN_1 WriteControl WriteEnable DL1 2x1_MUX  ; pins IN1 IN2 WriteControl WriteEnable OUT
XX30 Q0 DATA_IN_0 WriteControl WriteEnable DL0 2x1_MUX  ; pins IN1 IN2 WriteControl WriteEnable OUT
M5 N006 Rdy_Out DATA_OUT 0 NMOS l=180n w=440n
M6 DATA_OUT N007 N006 VDD PMOS l=180n w=440n
M7 N005 Rdy_Out N007 N005 PMOS l=180n w=880n
M8 N007 Rdy_Out 0 0 NMOS l=180n w=440n
V1 N005 0 1.8
.tran 0 4ns 0
* LOT: n94s                  WAF: 08
* Temperature_parameters=Default
.MODEL nmos nmos LEVEL = 8
+VERSION = 3.1            TNOM    = 27             TOX     = 5.8E-9
+XJ      = 1E-7           NCH     = 2.3549E17      VTH0    = 0.4308936
+K1      = 0.3519429      K2      = 0.0298493      K3      = 1E-3
+K3B     = 0.0592323      W0      = 1E-5           NLX     = 1.465901E-7
+DVT0W   = 0              DVT1W   = 0              DVT2W   = 0
+DVT0    = 0.0183405      DVT1    = 4.897584E-3    DVT2    = -0.0252658
+U0      = 455.3033362    UA      = 5.223592E-10   UB      = 1.104713E-18
+UC      = 3.287888E-11   VSAT    = 1.050993E5     A0      = 1.2318623
+AGS     = 0.3043334      B0      = 6.67749E-8     B1      = 5E-6
+KETA    = 8.518046E-4    A1      = 0              A2      = 1
+RDSW    = 509.5675851    PRWG    = 0.0227558      PRWB    = -1E-3
+WR      = 1              WINT    = 2.126497E-9    LINT    = 4.393474E-9
+XL      = -3E-8          XW      = 0              DWG     = -3.409033E-9
+DWB     = 2.794842E-9    VOFF    = -0.1026054     NFACTOR = 0.1344887
+CIT     = 0              CDSC    = 1.527511E-3    CDSCD   = 0
+CDSCB   = 0              ETA0    = 3.48737E-3     ETAB    = 4.557986E-4
+DSUB    = 3.045473E-3    PCLM    = 1.0446257      PDIBLC1 = 0.1441952
+PDIBLC2 = 4.513382E-4    PDIBLCB = -2.816756E-5   DROUT   = 0.4698725
+PSCBE1  = 1.761109E10    PSCBE2  = 3.772916E-9    PVAG    = 0.0361824
+DELTA   = 0.01           MOBMOD  = 1              PRT     = 0
+UTE     = -1.5           KT1     = -0.11          KT1L    = 0
+KT2     = 0.022          UA1     = 4.31E-9        UB1     = -7.61E-18
+UC1     = -5.6E-11       AT      = 3.3E4          WL      = 0
+WLN     = 1              WW      = 0              WWN     = 1
+WWL     = 0              LL      = 0              LLN     = 1
+LW      = 0              LWN     = 1              LWL     = 0
+CAPMOD  = 2              XPART   = 0.4            CGDO    = 6.27E-10
+CGSO    = 6.27E-10       CGBO    = 0              CJ      = 1.918655E-3
+PB      = 0.9784049      MJ      = 0.4721729      CJSW    = 4.441595E-10
+PBSW    = 0.9419636      MJSW    = 0.2871118      PVTH0   = 1.342985E-3
+PRDSW   = -61.8357222    PK2     = -3.140724E-3   WKETA   = 7.512693E-4
+LKETA   = -6.144062E-3
* LOT: n94s                  WAF: 08
* Temperature_parameters=Default
.MODEL pmos pmos LEVEL = 8
+VERSION = 3.1            TNOM    = 27             TOX     = 5.8E-9
+XJ      = 1E-7           NCH     = 4.1589E17      VTH0    = -0.6158735
+K1      = 0.4598379      K2      = 0.0399415      K3      = 0
+K3B     = 8.7410723      W0      = 1E-6           NLX     = 1E-9
+DVT0W   = 0              DVT1W   = 0              DVT2W   = 0
+DVT0    = 0.6249485      DVT1    = 0.203296       DVT2    = -0.0513763
+U0      = 158.67524      UA      = 2.200024E-10   UB      = 4.457415E-18
+UC      = 1.02138E-10    VSAT    = 1.85064E5      A0      = 1.3826397
+AGS     = 0.4192977      B0      = 2.844099E-6    B1      = 5E-6
+KETA    = 0.0208695      A1      = 0              A2      = 1
+RDSW    = 968.5463       PRWG    = -0.1026483     PRWB    = -0.325
+WR      = 1              WINT    = 2.748811E-8    LINT    = 8.71907E-9
+XL      = -3E-8          XW      = 0              DWG     = -4.087585E-8
+DWB     = 2.032008E-8    VOFF    = -0.15          NFACTOR = 1.5460516
+CIT     = 0              CDSC    = 1.413317E-4    CDSCD   = 0
+CDSCB   = 0              ETA0    = 0.3241245      ETAB    = -0.1842
+DSUB    = 1.0287138      PCLM    = 5.2654567      PDIBLC1 = 4.228338E-3
+PDIBLC2 = 1.204519E-3    PDIBLCB = 2.37525E-3     DROUT   = 0
+PSCBE1  = 3.011456E10    PSCBE2  = 3.037042E-7    PVAG    = 8.9564294
+DELTA   = 0.01           MOBMOD  = 1              PRT     = 0
+UTE     = -1.5           KT1     = -0.11          KT1L    = 0
+KT2     = 0.022          UA1     = 4.31E-9        UB1     = -7.61E-18
+UC1     = -5.6E-11       AT      = 3.3E4          WL      = 0
+WLN     = 1              WW      = 0              WWN     = 1
+WWL     = 0              LL      = 0              LLN     = 1
+LW      = 0              LWN     = 1              LWL     = 0
+CAPMOD  = 2              XPART   = 0.4            CGDO    = 5.59E-10
+CGSO    = 5.59E-10       CGBO    = 0              CJ      = 1.882857E-3
+PB      = 0.9891317      MJ      = 0.4679789      CJSW    = 3.67186E-10
+PBSW    = 0.9884654      MJSW    = 0.3562128      PVTH0   = 3.923756E-3
+PRDSW   = 15.3953053     PK2     = 2.061759E-3    WKETA   = 4.10049E-3
+LKETA   = -0.0232426     LVSAT   = 1.257E5
.ends 4x4_dram

.subckt 1t1c_cell DL WL
M3 N001 WL DL 0 NMOS l=180n w=1760n
C1 N001 0 46f
* LOT: n94s                  WAF: 08
* Temperature_parameters=Default
.MODEL nmos nmos LEVEL = 8
+VERSION = 3.1            TNOM    = 27             TOX     = 5.8E-9
+XJ      = 1E-7           NCH     = 2.3549E17      VTH0    = 0.4308936
+K1      = 0.3519429      K2      = 0.0298493      K3      = 1E-3
+K3B     = 0.0592323      W0      = 1E-5           NLX     = 1.465901E-7
+DVT0W   = 0              DVT1W   = 0              DVT2W   = 0
+DVT0    = 0.0183405      DVT1    = 4.897584E-3    DVT2    = -0.0252658
+U0      = 455.3033362    UA      = 5.223592E-10   UB      = 1.104713E-18
+UC      = 3.287888E-11   VSAT    = 1.050993E5     A0      = 1.2318623
+AGS     = 0.3043334      B0      = 6.67749E-8     B1      = 5E-6
+KETA    = 8.518046E-4    A1      = 0              A2      = 1
+RDSW    = 509.5675851    PRWG    = 0.0227558      PRWB    = -1E-3
+WR      = 1              WINT    = 2.126497E-9    LINT    = 4.393474E-9
+XL      = -3E-8          XW      = 0              DWG     = -3.409033E-9
+DWB     = 2.794842E-9    VOFF    = -0.1026054     NFACTOR = 0.1344887
+CIT     = 0              CDSC    = 1.527511E-3    CDSCD   = 0
+CDSCB   = 0              ETA0    = 3.48737E-3     ETAB    = 4.557986E-4
+DSUB    = 3.045473E-3    PCLM    = 1.0446257      PDIBLC1 = 0.1441952
+PDIBLC2 = 4.513382E-4    PDIBLCB = -2.816756E-5   DROUT   = 0.4698725
+PSCBE1  = 1.761109E10    PSCBE2  = 3.772916E-9    PVAG    = 0.0361824
+DELTA   = 0.01           MOBMOD  = 1              PRT     = 0
+UTE     = -1.5           KT1     = -0.11          KT1L    = 0
+KT2     = 0.022          UA1     = 4.31E-9        UB1     = -7.61E-18
+UC1     = -5.6E-11       AT      = 3.3E4          WL      = 0
+WLN     = 1              WW      = 0              WWN     = 1
+WWL     = 0              LL      = 0              LLN     = 1
+LW      = 0              LWN     = 1              LWL     = 0
+CAPMOD  = 2              XPART   = 0.4            CGDO    = 6.27E-10
+CGSO    = 6.27E-10       CGBO    = 0              CJ      = 1.918655E-3
+PB      = 0.9784049      MJ      = 0.4721729      CJSW    = 4.441595E-10
+PBSW    = 0.9419636      MJSW    = 0.2871118      PVTH0   = 1.342985E-3
+PRDSW   = -61.8357222    PK2     = -3.140724E-3   WKETA   = 7.512693E-4
+LKETA   = -6.144062E-3
* LOT: n94s                  WAF: 08
* Temperature_parameters=Default
.MODEL pmos pmos LEVEL = 8
+VERSION = 3.1            TNOM    = 27             TOX     = 5.8E-9
+XJ      = 1E-7           NCH     = 4.1589E17      VTH0    = -0.6158735
+K1      = 0.4598379      K2      = 0.0399415      K3      = 0
+K3B     = 8.7410723      W0      = 1E-6           NLX     = 1E-9
+DVT0W   = 0              DVT1W   = 0              DVT2W   = 0
+DVT0    = 0.6249485      DVT1    = 0.203296       DVT2    = -0.0513763
+U0      = 158.67524      UA      = 2.200024E-10   UB      = 4.457415E-18
+UC      = 1.02138E-10    VSAT    = 1.85064E5      A0      = 1.3826397
+AGS     = 0.4192977      B0      = 2.844099E-6    B1      = 5E-6
+KETA    = 0.0208695      A1      = 0              A2      = 1
+RDSW    = 968.5463       PRWG    = -0.1026483     PRWB    = -0.325
+WR      = 1              WINT    = 2.748811E-8    LINT    = 8.71907E-9
+XL      = -3E-8          XW      = 0              DWG     = -4.087585E-8
+DWB     = 2.032008E-8    VOFF    = -0.15          NFACTOR = 1.5460516
+CIT     = 0              CDSC    = 1.413317E-4    CDSCD   = 0
+CDSCB   = 0              ETA0    = 0.3241245      ETAB    = -0.1842
+DSUB    = 1.0287138      PCLM    = 5.2654567      PDIBLC1 = 4.228338E-3
+PDIBLC2 = 1.204519E-3    PDIBLCB = 2.37525E-3     DROUT   = 0
+PSCBE1  = 3.011456E10    PSCBE2  = 3.037042E-7    PVAG    = 8.9564294
+DELTA   = 0.01           MOBMOD  = 1              PRT     = 0
+UTE     = -1.5           KT1     = -0.11          KT1L    = 0
+KT2     = 0.022          UA1     = 4.31E-9        UB1     = -7.61E-18
+UC1     = -5.6E-11       AT      = 3.3E4          WL      = 0
+WLN     = 1              WW      = 0              WWN     = 1
+WWL     = 0              LL      = 0              LLN     = 1
+LW      = 0              LWN     = 1              LWL     = 0
+CAPMOD  = 2              XPART   = 0.4            CGDO    = 5.59E-10
+CGSO    = 5.59E-10       CGBO    = 0              CJ      = 1.882857E-3
+PB      = 0.9891317      MJ      = 0.4679789      CJSW    = 3.67186E-10
+PBSW    = 0.9884654      MJSW    = 0.3562128      PVTH0   = 3.923756E-3
+PRDSW   = 15.3953053     PK2     = 2.061759E-3    WKETA   = 4.10049E-3
+LKETA   = -0.0232426     LVSAT   = 1.257E5
.ends 1t1c_cell

.subckt sense_amplifier_en IN SENSE VDD OUT
M1 VDD IN N002 VDD PMOS l=180n w=880n
M2 N002 IN 0 0 NMOS l=180n w=440n
M3 VDD N002 N003 VDD PMOS l=180n w=880n
M4 N003 N002 0 0 NMOS l=180n w=440n
M5 VDD SENSE N001 VDD PMOS l=180n w=880n
M6 N001 SENSE 0 0 NMOS l=180n w=440n
M7 OUT N001 N003 VDD PMOS l=180n w=880n
M8 N003 SENSE OUT 0 NMOS l=180n w=440n
* LOT: n94s                  WAF: 08
* Temperature_parameters=Default
.MODEL nmos nmos LEVEL = 8
+VERSION = 3.1            TNOM    = 27             TOX     = 5.8E-9
+XJ      = 1E-7           NCH     = 2.3549E17      VTH0    = 0.4308936
+K1      = 0.3519429      K2      = 0.0298493      K3      = 1E-3
+K3B     = 0.0592323      W0      = 1E-5           NLX     = 1.465901E-7
+DVT0W   = 0              DVT1W   = 0              DVT2W   = 0
+DVT0    = 0.0183405      DVT1    = 4.897584E-3    DVT2    = -0.0252658
+U0      = 455.3033362    UA      = 5.223592E-10   UB      = 1.104713E-18
+UC      = 3.287888E-11   VSAT    = 1.050993E5     A0      = 1.2318623
+AGS     = 0.3043334      B0      = 6.67749E-8     B1      = 5E-6
+KETA    = 8.518046E-4    A1      = 0              A2      = 1
+RDSW    = 509.5675851    PRWG    = 0.0227558      PRWB    = -1E-3
+WR      = 1              WINT    = 2.126497E-9    LINT    = 4.393474E-9
+XL      = -3E-8          XW      = 0              DWG     = -3.409033E-9
+DWB     = 2.794842E-9    VOFF    = -0.1026054     NFACTOR = 0.1344887
+CIT     = 0              CDSC    = 1.527511E-3    CDSCD   = 0
+CDSCB   = 0              ETA0    = 3.48737E-3     ETAB    = 4.557986E-4
+DSUB    = 3.045473E-3    PCLM    = 1.0446257      PDIBLC1 = 0.1441952
+PDIBLC2 = 4.513382E-4    PDIBLCB = -2.816756E-5   DROUT   = 0.4698725
+PSCBE1  = 1.761109E10    PSCBE2  = 3.772916E-9    PVAG    = 0.0361824
+DELTA   = 0.01           MOBMOD  = 1              PRT     = 0
+UTE     = -1.5           KT1     = -0.11          KT1L    = 0
+KT2     = 0.022          UA1     = 4.31E-9        UB1     = -7.61E-18
+UC1     = -5.6E-11       AT      = 3.3E4          WL      = 0
+WLN     = 1              WW      = 0              WWN     = 1
+WWL     = 0              LL      = 0              LLN     = 1
+LW      = 0              LWN     = 1              LWL     = 0
+CAPMOD  = 2              XPART   = 0.4            CGDO    = 6.27E-10
+CGSO    = 6.27E-10       CGBO    = 0              CJ      = 1.918655E-3
+PB      = 0.9784049      MJ      = 0.4721729      CJSW    = 4.441595E-10
+PBSW    = 0.9419636      MJSW    = 0.2871118      PVTH0   = 1.342985E-3
+PRDSW   = -61.8357222    PK2     = -3.140724E-3   WKETA   = 7.512693E-4
+LKETA   = -6.144062E-3
* LOT: n94s                  WAF: 08
* Temperature_parameters=Default
.MODEL pmos pmos LEVEL = 8
+VERSION = 3.1            TNOM    = 27             TOX     = 5.8E-9
+XJ      = 1E-7           NCH     = 4.1589E17      VTH0    = -0.6158735
+K1      = 0.4598379      K2      = 0.0399415      K3      = 0
+K3B     = 8.7410723      W0      = 1E-6           NLX     = 1E-9
+DVT0W   = 0              DVT1W   = 0              DVT2W   = 0
+DVT0    = 0.6249485      DVT1    = 0.203296       DVT2    = -0.0513763
+U0      = 158.67524      UA      = 2.200024E-10   UB      = 4.457415E-18
+UC      = 1.02138E-10    VSAT    = 1.85064E5      A0      = 1.3826397
+AGS     = 0.4192977      B0      = 2.844099E-6    B1      = 5E-6
+KETA    = 0.0208695      A1      = 0              A2      = 1
+RDSW    = 968.5463       PRWG    = -0.1026483     PRWB    = -0.325
+WR      = 1              WINT    = 2.748811E-8    LINT    = 8.71907E-9
+XL      = -3E-8          XW      = 0              DWG     = -4.087585E-8
+DWB     = 2.032008E-8    VOFF    = -0.15          NFACTOR = 1.5460516
+CIT     = 0              CDSC    = 1.413317E-4    CDSCD   = 0
+CDSCB   = 0              ETA0    = 0.3241245      ETAB    = -0.1842
+DSUB    = 1.0287138      PCLM    = 5.2654567      PDIBLC1 = 4.228338E-3
+PDIBLC2 = 1.204519E-3    PDIBLCB = 2.37525E-3     DROUT   = 0
+PSCBE1  = 3.011456E10    PSCBE2  = 3.037042E-7    PVAG    = 8.9564294
+DELTA   = 0.01           MOBMOD  = 1              PRT     = 0
+UTE     = -1.5           KT1     = -0.11          KT1L    = 0
+KT2     = 0.022          UA1     = 4.31E-9        UB1     = -7.61E-18
+UC1     = -5.6E-11       AT      = 3.3E4          WL      = 0
+WLN     = 1              WW      = 0              WWN     = 1
+WWL     = 0              LL      = 0              LLN     = 1
+LW      = 0              LWN     = 1              LWL     = 0
+CAPMOD  = 2              XPART   = 0.4            CGDO    = 5.59E-10
+CGSO    = 5.59E-10       CGBO    = 0              CJ      = 1.882857E-3
+PB      = 0.9891317      MJ      = 0.4679789      CJSW    = 3.67186E-10
+PBSW    = 0.9884654      MJSW    = 0.3562128      PVTH0   = 3.923756E-3
+PRDSW   = 15.3953053     PK2     = 2.061759E-3    WKETA   = 4.10049E-3
+LKETA   = -0.0232426     LVSAT   = 1.257E5
.tran 0 8ns 0
.ends sense_amplifier_en

.subckt dff_with_cntrs CLOCK D ENABLE RESET Q
M3 N002 CLK N007 0 NMOS l=180n w=440n
M4 N002 N009 D 0 NMOS l=180n w=440n
M1 N012 CLK N009 N012 PMOS l=180n w=880n
M2 N009 CLK 0 0 NMOS l=180n w=440n
V3 N008 0 1.8
V4 CLOCK 0 PULSE(1.8 0 0 10p 10p 0.5n 1n 16)
M5 N007 N009 N002 N008 PMOS l=180n w=440n
M6 D CLK N002 N008 PMOS l=180n w=440n
M7 Q_OUT CLK N002 0 NMOS l=180n w=440n
M8 Q_OUT N009 N011 0 NMOS l=180n w=440n
V2 N006 0 1.8
M9 N002 N009 Q_OUT N006 PMOS l=180n w=440n
M10 N011 CLK Q_OUT N006 PMOS l=180n w=440n
M11 N004 N002 N010 N004 PMOS l=180n w=880n
M12 N010 N002 0 0 NMOS l=180n w=440n
V5 N004 0 1.8
M13 N005 N010 N007 N005 PMOS l=180n w=880n
M14 N007 N010 0 0 NMOS l=180n w=440n
V6 N005 0 1.8
M15 N014 Q_OUT N017 N014 PMOS l=180n w=880n
M16 N017 Q_OUT 0 0 NMOS l=180n w=440n
V7 N014 0 1.8
M17 N015 N017 N011 N015 PMOS l=180n w=880n
M18 N011 N017 0 0 NMOS l=180n w=440n
V8 N015 0 1.8
V9 N012 0 1.8
M19 N003 Q_OUT P001 0 NMOS l=180n w=880n
M20 P001 RESET 0 0 NMOS l=180n w=880n
M21 N001 Q_OUT N003 N001 PMOS l=180n w=880n
M22 N001 RESET N003 N001 PMOS l=180n w=880n
V10 N001 0 1.8
M23 N016 CLOCK P002 0 NMOS l=180n w=880n
M24 P002 ENABLE 0 0 NMOS l=180n w=880n
M25 N013 CLOCK N016 N013 PMOS l=180n w=880n
M26 N013 ENABLE N016 N013 PMOS l=180n w=880n
V13 N013 0 1.8
M27 N001 N003 Q N001 PMOS l=180n w=880n
M28 Q N003 0 0 NMOS l=180n w=440n
M29 N013 N016 CLK N013 PMOS l=180n w=880n
M30 CLK N016 0 0 NMOS l=180n w=440n
V11 RESET 0 PULSE(1.8 0 0 10p 10p 5n 10n 6)
V12 ENABLE 0 PULSE(1.8 0 0 10p 10p 3n 6n 6)
V1 D 0 PULSE(1.8 0 0 10p 10p 1n 2n 12)
.tran 0 16ns 0
* LOT: n94s                  WAF: 08
* Temperature_parameters=Default
.MODEL nmos nmos LEVEL = 8
+VERSION = 3.1            TNOM    = 27             TOX     = 5.8E-9
+XJ      = 1E-7           NCH     = 2.3549E17      VTH0    = 0.4308936
+K1      = 0.3519429      K2      = 0.0298493      K3      = 1E-3
+K3B     = 0.0592323      W0      = 1E-5           NLX     = 1.465901E-7
+DVT0W   = 0              DVT1W   = 0              DVT2W   = 0
+DVT0    = 0.0183405      DVT1    = 4.897584E-3    DVT2    = -0.0252658
+U0      = 455.3033362    UA      = 5.223592E-10   UB      = 1.104713E-18
+UC      = 3.287888E-11   VSAT    = 1.050993E5     A0      = 1.2318623
+AGS     = 0.3043334      B0      = 6.67749E-8     B1      = 5E-6
+KETA    = 8.518046E-4    A1      = 0              A2      = 1
+RDSW    = 509.5675851    PRWG    = 0.0227558      PRWB    = -1E-3
+WR      = 1              WINT    = 2.126497E-9    LINT    = 4.393474E-9
+XL      = -3E-8          XW      = 0              DWG     = -3.409033E-9
+DWB     = 2.794842E-9    VOFF    = -0.1026054     NFACTOR = 0.1344887
+CIT     = 0              CDSC    = 1.527511E-3    CDSCD   = 0
+CDSCB   = 0              ETA0    = 3.48737E-3     ETAB    = 4.557986E-4
+DSUB    = 3.045473E-3    PCLM    = 1.0446257      PDIBLC1 = 0.1441952
+PDIBLC2 = 4.513382E-4    PDIBLCB = -2.816756E-5   DROUT   = 0.4698725
+PSCBE1  = 1.761109E10    PSCBE2  = 3.772916E-9    PVAG    = 0.0361824
+DELTA   = 0.01           MOBMOD  = 1              PRT     = 0
+UTE     = -1.5           KT1     = -0.11          KT1L    = 0
+KT2     = 0.022          UA1     = 4.31E-9        UB1     = -7.61E-18
+UC1     = -5.6E-11       AT      = 3.3E4          WL      = 0
+WLN     = 1              WW      = 0              WWN     = 1
+WWL     = 0              LL      = 0              LLN     = 1
+LW      = 0              LWN     = 1              LWL     = 0
+CAPMOD  = 2              XPART   = 0.4            CGDO    = 6.27E-10
+CGSO    = 6.27E-10       CGBO    = 0              CJ      = 1.918655E-3
+PB      = 0.9784049      MJ      = 0.4721729      CJSW    = 4.441595E-10
+PBSW    = 0.9419636      MJSW    = 0.2871118      PVTH0   = 1.342985E-3
+PRDSW   = -61.8357222    PK2     = -3.140724E-3   WKETA   = 7.512693E-4
+LKETA   = -6.144062E-3
* LOT: n94s                  WAF: 08
* Temperature_parameters=Default
.MODEL pmos pmos LEVEL = 8
+VERSION = 3.1            TNOM    = 27             TOX     = 5.8E-9
+XJ      = 1E-7           NCH     = 4.1589E17      VTH0    = -0.6158735
+K1      = 0.4598379      K2      = 0.0399415      K3      = 0
+K3B     = 8.7410723      W0      = 1E-6           NLX     = 1E-9
+DVT0W   = 0              DVT1W   = 0              DVT2W   = 0
+DVT0    = 0.6249485      DVT1    = 0.203296       DVT2    = -0.0513763
+U0      = 158.67524      UA      = 2.200024E-10   UB      = 4.457415E-18
+UC      = 1.02138E-10    VSAT    = 1.85064E5      A0      = 1.3826397
+AGS     = 0.4192977      B0      = 2.844099E-6    B1      = 5E-6
+KETA    = 0.0208695      A1      = 0              A2      = 1
+RDSW    = 968.5463       PRWG    = -0.1026483     PRWB    = -0.325
+WR      = 1              WINT    = 2.748811E-8    LINT    = 8.71907E-9
+XL      = -3E-8          XW      = 0              DWG     = -4.087585E-8
+DWB     = 2.032008E-8    VOFF    = -0.15          NFACTOR = 1.5460516
+CIT     = 0              CDSC    = 1.413317E-4    CDSCD   = 0
+CDSCB   = 0              ETA0    = 0.3241245      ETAB    = -0.1842
+DSUB    = 1.0287138      PCLM    = 5.2654567      PDIBLC1 = 4.228338E-3
+PDIBLC2 = 1.204519E-3    PDIBLCB = 2.37525E-3     DROUT   = 0
+PSCBE1  = 3.011456E10    PSCBE2  = 3.037042E-7    PVAG    = 8.9564294
+DELTA   = 0.01           MOBMOD  = 1              PRT     = 0
+UTE     = -1.5           KT1     = -0.11          KT1L    = 0
+KT2     = 0.022          UA1     = 4.31E-9        UB1     = -7.61E-18
+UC1     = -5.6E-11       AT      = 3.3E4          WL      = 0
+WLN     = 1              WW      = 0              WWN     = 1
+WWL     = 0              LL      = 0              LLN     = 1
+LW      = 0              LWN     = 1              LWL     = 0
+CAPMOD  = 2              XPART   = 0.4            CGDO    = 5.59E-10
+CGSO    = 5.59E-10       CGBO    = 0              CJ      = 1.882857E-3
+PB      = 0.9891317      MJ      = 0.4679789      CJSW    = 3.67186E-10
+PBSW    = 0.9884654      MJSW    = 0.3562128      PVTH0   = 3.923756E-3
+PRDSW   = 15.3953053     PK2     = 2.061759E-3    WKETA   = 4.10049E-3
+LKETA   = -0.0232426     LVSAT   = 1.257E5
.ends dff_with_cntrs

.subckt 3bit_counter CLOCK ENABLE VDD Q1 Q1bar Q2 Q2bar Q3 Q3bar
M7 N001 Q1 Q1bar N001 PMOS l=180n w=880n
M8 Q1bar Q1 0 0 NMOS l=180n w=440n
V4 N001 0 1.8
M9 N002 Q2 Q2bar N002 PMOS l=180n w=880n
M10 Q2bar Q2 0 0 NMOS l=180n w=440n
V5 N002 0 1.8
M11 N003 Q3 Q3bar N003 PMOS l=180n w=880n
M12 Q3bar Q3 0 0 NMOS l=180n w=440n
V6 N003 0 1.8
XX1 Q1bar CLK Q1 DFF_Using_Mux  ; pins D CLOCK OUT
XX2 Q2bar Q1bar Q2 DFF_Using_Mux  ; pins D CLOCK OUT
XX3 Q3bar Q2bar Q3 DFF_Using_Mux  ; pins D CLOCK OUT
M1 N004 CLOCK P001 0 NMOS l=180n w=880n
M2 P001 ENABLE 0 0 NMOS l=180n w=880n
M3 VDD CLOCK N004 VDD PMOS l=180n w=880n
M4 VDD ENABLE N004 VDD PMOS l=180n w=880n
M5 VDD N004 CLK VDD PMOS l=180n w=880n
M6 CLK N004 0 0 NMOS l=180n w=440n
* LOT: n94s                  WAF: 08
* Temperature_parameters=Default
.MODEL pmos pmos LEVEL = 8
+VERSION = 3.1            TNOM    = 27             TOX     = 5.8E-9
+XJ      = 1E-7           NCH     = 4.1589E17      VTH0    = -0.6158735
+K1      = 0.4598379      K2      = 0.0399415      K3      = 0
+K3B     = 8.7410723      W0      = 1E-6           NLX     = 1E-9
+DVT0W   = 0              DVT1W   = 0              DVT2W   = 0
+DVT0    = 0.6249485      DVT1    = 0.203296       DVT2    = -0.0513763
+U0      = 158.67524      UA      = 2.200024E-10   UB      = 4.457415E-18
+UC      = 1.02138E-10    VSAT    = 1.85064E5      A0      = 1.3826397
+AGS     = 0.4192977      B0      = 2.844099E-6    B1      = 5E-6
+KETA    = 0.0208695      A1      = 0              A2      = 1
+RDSW    = 968.5463       PRWG    = -0.1026483     PRWB    = -0.325
+WR      = 1              WINT    = 2.748811E-8    LINT    = 8.71907E-9
+XL      = -3E-8          XW      = 0              DWG     = -4.087585E-8
+DWB     = 2.032008E-8    VOFF    = -0.15          NFACTOR = 1.5460516
+CIT     = 0              CDSC    = 1.413317E-4    CDSCD   = 0
+CDSCB   = 0              ETA0    = 0.3241245      ETAB    = -0.1842
+DSUB    = 1.0287138      PCLM    = 5.2654567      PDIBLC1 = 4.228338E-3
+PDIBLC2 = 1.204519E-3    PDIBLCB = 2.37525E-3     DROUT   = 0
+PSCBE1  = 3.011456E10    PSCBE2  = 3.037042E-7    PVAG    = 8.9564294
+DELTA   = 0.01           MOBMOD  = 1              PRT     = 0
+UTE     = -1.5           KT1     = -0.11          KT1L    = 0
+KT2     = 0.022          UA1     = 4.31E-9        UB1     = -7.61E-18
+UC1     = -5.6E-11       AT      = 3.3E4          WL      = 0
+WLN     = 1              WW      = 0              WWN     = 1
+WWL     = 0              LL      = 0              LLN     = 1
+LW      = 0              LWN     = 1              LWL     = 0
+CAPMOD  = 2              XPART   = 0.4            CGDO    = 5.59E-10
+CGSO    = 5.59E-10       CGBO    = 0              CJ      = 1.882857E-3
+PB      = 0.9891317      MJ      = 0.4679789      CJSW    = 3.67186E-10
+PBSW    = 0.9884654      MJSW    = 0.3562128      PVTH0   = 3.923756E-3
+PRDSW   = 15.3953053     PK2     = 2.061759E-3    WKETA   = 4.10049E-3
+LKETA   = -0.0232426     LVSAT   = 1.257E5
* LOT: n94s                  WAF: 08
* Temperature_parameters=Default
.MODEL nmos nmos LEVEL = 8
+VERSION = 3.1            TNOM    = 27             TOX     = 5.8E-9
+XJ      = 1E-7           NCH     = 2.3549E17      VTH0    = 0.4308936
+K1      = 0.3519429      K2      = 0.0298493      K3      = 1E-3
+K3B     = 0.0592323      W0      = 1E-5           NLX     = 1.465901E-7
+DVT0W   = 0              DVT1W   = 0              DVT2W   = 0
+DVT0    = 0.0183405      DVT1    = 4.897584E-3    DVT2    = -0.0252658
+U0      = 455.3033362    UA      = 5.223592E-10   UB      = 1.104713E-18
+UC      = 3.287888E-11   VSAT    = 1.050993E5     A0      = 1.2318623
+AGS     = 0.3043334      B0      = 6.67749E-8     B1      = 5E-6
+KETA    = 8.518046E-4    A1      = 0              A2      = 1
+RDSW    = 509.5675851    PRWG    = 0.0227558      PRWB    = -1E-3
+WR      = 1              WINT    = 2.126497E-9    LINT    = 4.393474E-9
+XL      = -3E-8          XW      = 0              DWG     = -3.409033E-9
+DWB     = 2.794842E-9    VOFF    = -0.1026054     NFACTOR = 0.1344887
+CIT     = 0              CDSC    = 1.527511E-3    CDSCD   = 0
+CDSCB   = 0              ETA0    = 3.48737E-3     ETAB    = 4.557986E-4
+DSUB    = 3.045473E-3    PCLM    = 1.0446257      PDIBLC1 = 0.1441952
+PDIBLC2 = 4.513382E-4    PDIBLCB = -2.816756E-5   DROUT   = 0.4698725
+PSCBE1  = 1.761109E10    PSCBE2  = 3.772916E-9    PVAG    = 0.0361824
+DELTA   = 0.01           MOBMOD  = 1              PRT     = 0
+UTE     = -1.5           KT1     = -0.11          KT1L    = 0
+KT2     = 0.022          UA1     = 4.31E-9        UB1     = -7.61E-18
+UC1     = -5.6E-11       AT      = 3.3E4          WL      = 0
+WLN     = 1              WW      = 0              WWN     = 1
+WWL     = 0              LL      = 0              LLN     = 1
+LW      = 0              LWN     = 1              LWL     = 0
+CAPMOD  = 2              XPART   = 0.4            CGDO    = 6.27E-10
+CGSO    = 6.27E-10       CGBO    = 0              CJ      = 1.918655E-3
+PB      = 0.9784049      MJ      = 0.4721729      CJSW    = 4.441595E-10
+PBSW    = 0.9419636      MJSW    = 0.2871118      PVTH0   = 1.342985E-3
+PRDSW   = -61.8357222    PK2     = -3.140724E-3   WKETA   = 7.512693E-4
+LKETA   = -6.144062E-3
.tran 0 20ns 0
.ends 3bit_counter

.model NMOS NMOS
.model PMOS PMOS
.lib standard.mos
.tran 0 80ns 0
* LOT: n94s                  WAF: 08
* Temperature_parameters=Default
.MODEL nmos nmos LEVEL = 8
+VERSION = 3.1            TNOM    = 27             TOX     = 5.8E-9
+XJ      = 1E-7           NCH     = 2.3549E17      VTH0    = 0.4308936
+K1      = 0.3519429      K2      = 0.0298493      K3      = 1E-3
+K3B     = 0.0592323      W0      = 1E-5           NLX     = 1.465901E-7
+DVT0W   = 0              DVT1W   = 0              DVT2W   = 0
+DVT0    = 0.0183405      DVT1    = 4.897584E-3    DVT2    = -0.0252658
+U0      = 455.3033362    UA      = 5.223592E-10   UB      = 1.104713E-18
+UC      = 3.287888E-11   VSAT    = 1.050993E5     A0      = 1.2318623
+AGS     = 0.3043334      B0      = 6.67749E-8     B1      = 5E-6
+KETA    = 8.518046E-4    A1      = 0              A2      = 1
+RDSW    = 509.5675851    PRWG    = 0.0227558      PRWB    = -1E-3
+WR      = 1              WINT    = 2.126497E-9    LINT    = 4.393474E-9
+XL      = -3E-8          XW      = 0              DWG     = -3.409033E-9
+DWB     = 2.794842E-9    VOFF    = -0.1026054     NFACTOR = 0.1344887
+CIT     = 0              CDSC    = 1.527511E-3    CDSCD   = 0
+CDSCB   = 0              ETA0    = 3.48737E-3     ETAB    = 4.557986E-4
+DSUB    = 3.045473E-3    PCLM    = 1.0446257      PDIBLC1 = 0.1441952
+PDIBLC2 = 4.513382E-4    PDIBLCB = -2.816756E-5   DROUT   = 0.4698725
+PSCBE1  = 1.761109E10    PSCBE2  = 3.772916E-9    PVAG    = 0.0361824
+DELTA   = 0.01           MOBMOD  = 1              PRT     = 0
+UTE     = -1.5           KT1     = -0.11          KT1L    = 0
+KT2     = 0.022          UA1     = 4.31E-9        UB1     = -7.61E-18
+UC1     = -5.6E-11       AT      = 3.3E4          WL      = 0
+WLN     = 1              WW      = 0              WWN     = 1
+WWL     = 0              LL      = 0              LLN     = 1
+LW      = 0              LWN     = 1              LWL     = 0
+CAPMOD  = 2              XPART   = 0.4            CGDO    = 6.27E-10
+CGSO    = 6.27E-10       CGBO    = 0              CJ      = 1.918655E-3
+PB      = 0.9784049      MJ      = 0.4721729      CJSW    = 4.441595E-10
+PBSW    = 0.9419636      MJSW    = 0.2871118      PVTH0   = 1.342985E-3
+PRDSW   = -61.8357222    PK2     = -3.140724E-3   WKETA   = 7.512693E-4
+LKETA   = -6.144062E-3
* LOT: n94s                  WAF: 08
* Temperature_parameters=Default
.MODEL pmos pmos LEVEL = 8
+VERSION = 3.1            TNOM    = 27             TOX     = 5.8E-9
+XJ      = 1E-7           NCH     = 4.1589E17      VTH0    = -0.6158735
+K1      = 0.4598379      K2      = 0.0399415      K3      = 0
+K3B     = 8.7410723      W0      = 1E-6           NLX     = 1E-9
+DVT0W   = 0              DVT1W   = 0              DVT2W   = 0
+DVT0    = 0.6249485      DVT1    = 0.203296       DVT2    = -0.0513763
+U0      = 158.67524      UA      = 2.200024E-10   UB      = 4.457415E-18
+UC      = 1.02138E-10    VSAT    = 1.85064E5      A0      = 1.3826397
+AGS     = 0.4192977      B0      = 2.844099E-6    B1      = 5E-6
+KETA    = 0.0208695      A1      = 0              A2      = 1
+RDSW    = 968.5463       PRWG    = -0.1026483     PRWB    = -0.325
+WR      = 1              WINT    = 2.748811E-8    LINT    = 8.71907E-9
+XL      = -3E-8          XW      = 0              DWG     = -4.087585E-8
+DWB     = 2.032008E-8    VOFF    = -0.15          NFACTOR = 1.5460516
+CIT     = 0              CDSC    = 1.413317E-4    CDSCD   = 0
+CDSCB   = 0              ETA0    = 0.3241245      ETAB    = -0.1842
+DSUB    = 1.0287138      PCLM    = 5.2654567      PDIBLC1 = 4.228338E-3
+PDIBLC2 = 1.204519E-3    PDIBLCB = 2.37525E-3     DROUT   = 0
+PSCBE1  = 3.011456E10    PSCBE2  = 3.037042E-7    PVAG    = 8.9564294
+DELTA   = 0.01           MOBMOD  = 1              PRT     = 0
+UTE     = -1.5           KT1     = -0.11          KT1L    = 0
+KT2     = 0.022          UA1     = 4.31E-9        UB1     = -7.61E-18
+UC1     = -5.6E-11       AT      = 3.3E4          WL      = 0
+WLN     = 1              WW      = 0              WWN     = 1
+WWL     = 0              LL      = 0              LLN     = 1
+LW      = 0              LWN     = 1              LWL     = 0
+CAPMOD  = 2              XPART   = 0.4            CGDO    = 5.59E-10
+CGSO    = 5.59E-10       CGBO    = 0              CJ      = 1.882857E-3
+PB      = 0.9891317      MJ      = 0.4679789      CJSW    = 3.67186E-10
+PBSW    = 0.9884654      MJSW    = 0.3562128      PVTH0   = 3.923756E-3
+PRDSW   = 15.3953053     PK2     = 2.061759E-3    WKETA   = 4.10049E-3
+LKETA   = -0.0232426     LVSAT   = 1.257E5
.backanno
.end